# Altium project WL_VHF.PrjPcb
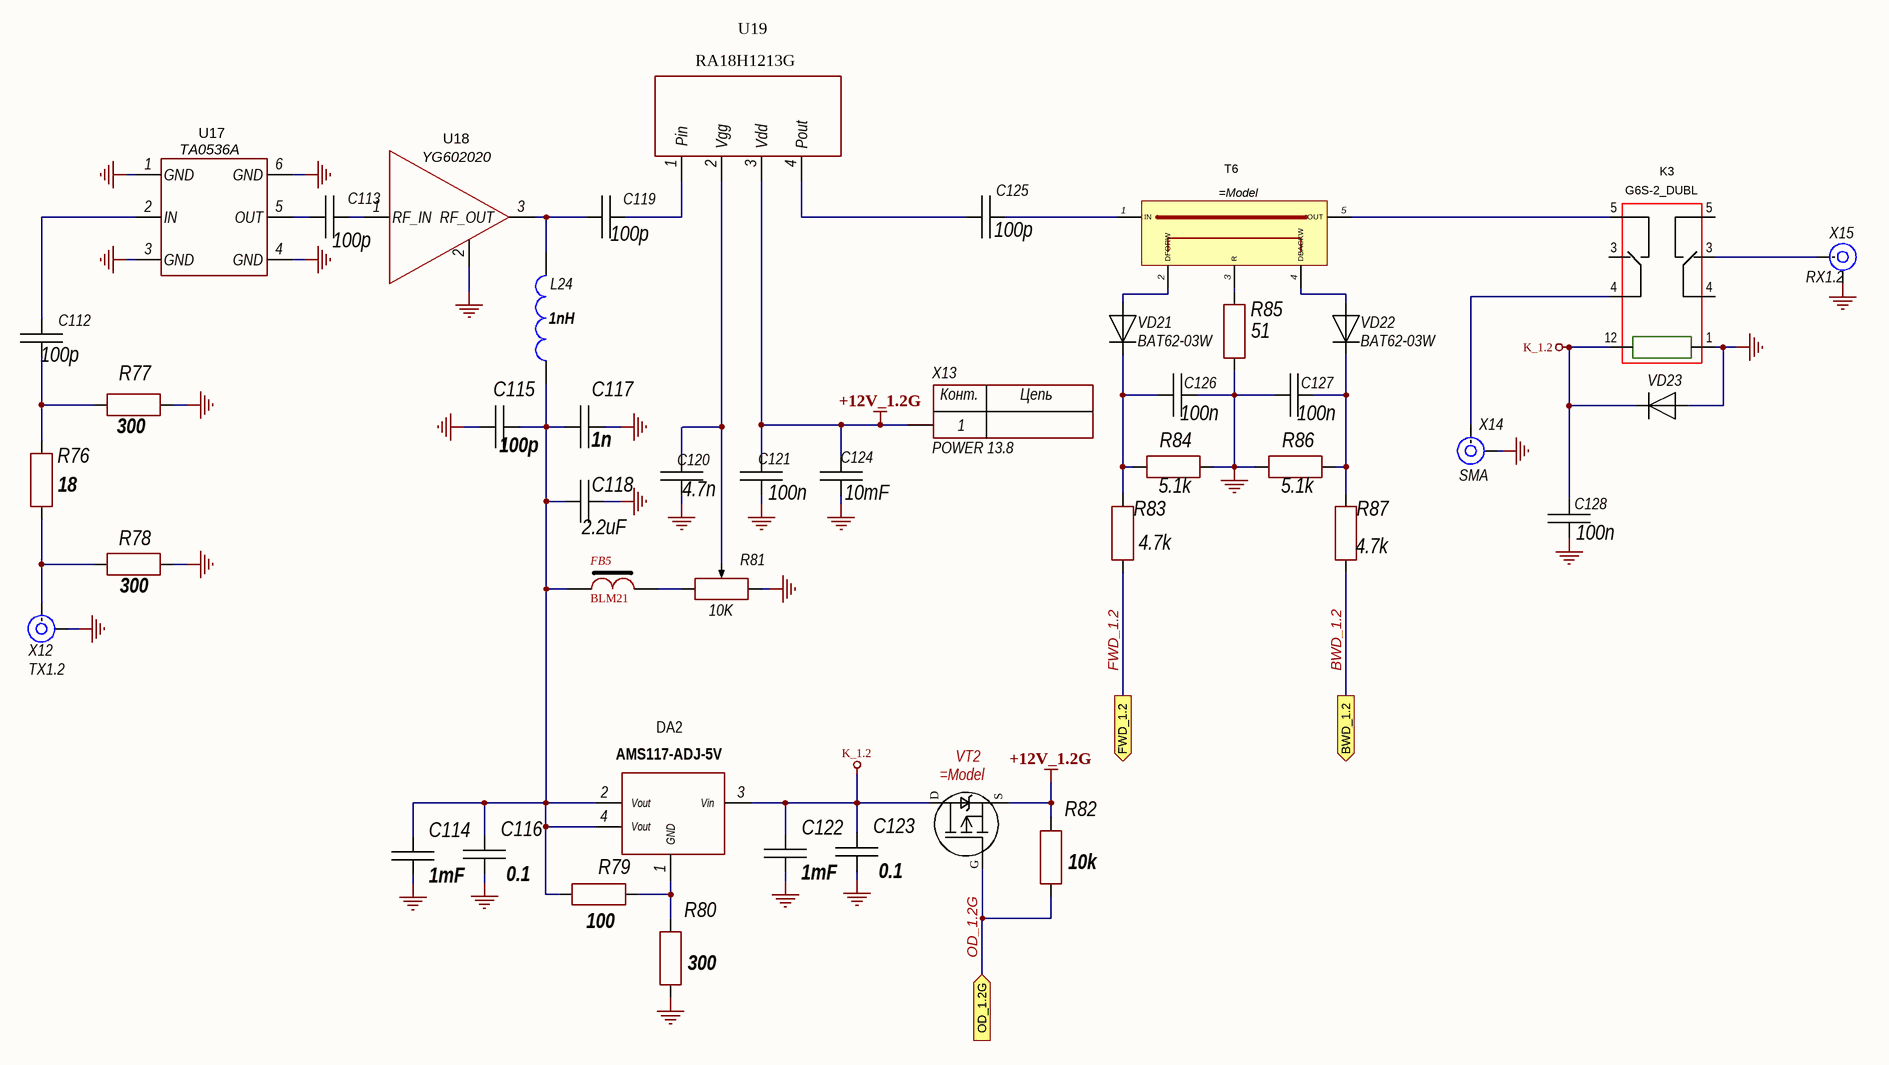
[diagram p0: WL_1.2G.SchDoc]
8 sheets, 334 parts. Net scope: global (net labels, ports and power ports of the same name join across sheets).
Board file: WL_RFFC.PcbDoc
Sheets:
  WL_1.2G.SchDoc
  WL_RFFC.SchDoc
  WL_PGA_ATT.SchDoc
  WL_CON.SchDoc
  WL_RF_SWITCH.SchDoc
  WL_144.SchDoc
  WL_BPF.SchDoc
  WL_430.SchDoc

## Sheet WL_1.2G.SchDoc
size 420 x 297 mm; SheetNumber: 2; SheetTotal: 9

### Parts
C112  100p  [CH0603C]
C113  100p  [CH0603C]
C114  1mF  [CH0603C]
C115  100p  [CH0603C]
C116  0.1  [CH0805C]
C117  1n  [CH0603C]
C118  2.2uF  [CH0603C]
C119  100p  [CH0805C]
C120  4.7n  [CH0805C]
C121  100n  [CH1206C]
C122  1mF  [CH0805C]
C123  0.1  [CH0805C]
C124  10mF  [CH1206C]
C125  100p  [CH1210C]
C126  100n  [CH0603C]
C127  100n  [CH0603C]
C128  100n  [CH0805C]
DA2  AMS117-ADJ-5V  [SOT223]
FB5  BLM21  [CH0805L]
K3  G6S-2_DUBL  [G6S-2_DUBL]
L24  1nH  [katuhka]
R76  18  [CH0603R]
R77  300  [CH0603R]
R78  300  [CH0603R]
R79  100  [CH0805R]
R80  300  [CH0805R]
R81  10K  [RES: 3296W]
R82  10k  [CH0805R]
R83  4.7k  [CH0603R]
R84  5.1k  [CH0603R]
R85  51  [CH1206R]
R86  5.1k  [CH0603R]
R87  4.7k  [CH0603R]
T6  (no value)  [SWR_D]
U17  TA0536A  [MA08803]
U18  YG602020  [SOT89_123]
U19  RA18H1213G  [RA80H1415M1 - duplicate]
VD21  BAT62-03W  [1N4148]
VD22  BAT62-03W  [1N4148]
VD23  (no value)  [1N4148]
VT2  (no value)  [SOT23_132]
X12  TX1.2  [CON: u.Fl]
X13  POWER 13.8  [CON: KNIFE_5MM]
X14  SMA  [CON: SMA]
X15  RX1.2  [CON: u.Fl]

### Ports
BWD_1.2 (out), FWD_1.2 (out), OD_1.2G (in)

### Nets
+12V_1.2G: C121.2 C124.2 R82.2 U19.3(Vdd) VT2.2(Исток) X13.1
GND: C114.1 C115.2 C116.1 C117.2 C118.2 C120.1 C121.1 C122.1 C123.1 C124.1 C126.1 C127.2 C128.2 K3.1 R77.1 R78.1 R80.1 R81.1 R84.1 R85.1 R86.2 U17.1(GND) U17.3(GND) U17.4(GND) U17.6(GND) U18.2(GND) VD23.1 X12.2(IN) X14.2(IN) X15.2(IN)
K_1.2: C122.2 C123.2 C128.1 DA2.3(Vin) K3.12 VD23.2 VT2.3(Сток)
BWD_1.2: R87.2 ; port BWD_1.2
FWD_1.2: R83.2 ; port FWD_1.2
OD_1.2G: R82.1 VT2.1(Затвор(Gate)) ; port OD_1.2G
NetC112_1: C112.1 U17.2(IN)
NetC112_2: C112.2 R76.1 R77.2
NetC113_1: C113.1 U18.1(RF_IN)
NetC113_2: C113.2 U17.5(OUT)
NetC114_2: C114.2 C115.1 C116.2 C117.1 C118.1 DA2.2(Vout) DA2.4(Vout) FB5.1 L24.2 R79.2
NetC119_1: C119.1 U19.1(Pin)
NetC119_2: C119.2 L24.1 U18.3(RF_OUT)
NetC120_2: C120.2 R81.2 U19.2(Vgg)
NetC125_1: C125.1 T6.1(IN)
NetC125_2: C125.2 U19.4(Pout)
NetC126_2: C126.2 R83.1 R84.2 VD21.2
NetC127_1: C127.1 R86.1 R87.1 VD22.2
NetDA2_1: DA2.1(GND) R79.1 R80.2
NetFB5_2: FB5.2 R81.3
NetK3_3: K3.3 X15.1(IN)
NetK3_4: K3.4 X14.1(IN)
NetK3_5: K3.5 T6.5(OUT)
NetR76_2: R76.2 R78.2 X12.1(IN)
NetR85_2: R85.2 T6.3(R)
NetT6_2: T6.2(DFORW) VD21.1
NetT6_4: T6.4(DBACKW) VD22.1

### Notes on the sheet
- Подп. и дата
- Инв. № дубл.
- Взам. инв. №
- Инв. № подл.
- Изм.
- Лист
- № докум.
- Подп.
- Дата
- 2.106-A3
- Копировал
- Формат А3
- (in symbol 1-Connector) Конт.; Цепь
- (in symbol P-KANAL) D; S; G

### Library data of the parts
C112-C128 = Capacitor: Manufacturer: *; Model: *; HelpURL: *; ComponentKind: *; Value: *
DA2 = AMS117
FB5 = FB-1
L24 = Inductor ring: Value: {Value}; Model: *; ComponentKind: *; Manufacturer: *; HelpURL: *
R76-R80 R82-R87 = Resistor: Manufacturer: *; Model: *; HelpURL: *; ComponentKind: *; Value: *
R81 = ADJ resistor: Manufacturer: *; Model: *; HelpURL: *; ComponentKind: *; Value: *
T6 = VHF_KSV1
U17 = TAU692
U19 = RA80H1415M1
VD21-VD23 = Diod: ComponentKind: *; Manufacturer: *; Model: *; HelpURL: *
VT2 = P-KANAL
X12 X14 X15 = SMA: RF; Model: *; Manufacturer: *; HelpURL: *; ComponentKind: *
X13 = 1-Connector: Model: *; Manufacturer: *; HelpURL: *; ComponentKind: *

## Sheet WL_RFFC.SchDoc
size 594 x 420 mm; SheetNumber: 3; SheetTotal: 9
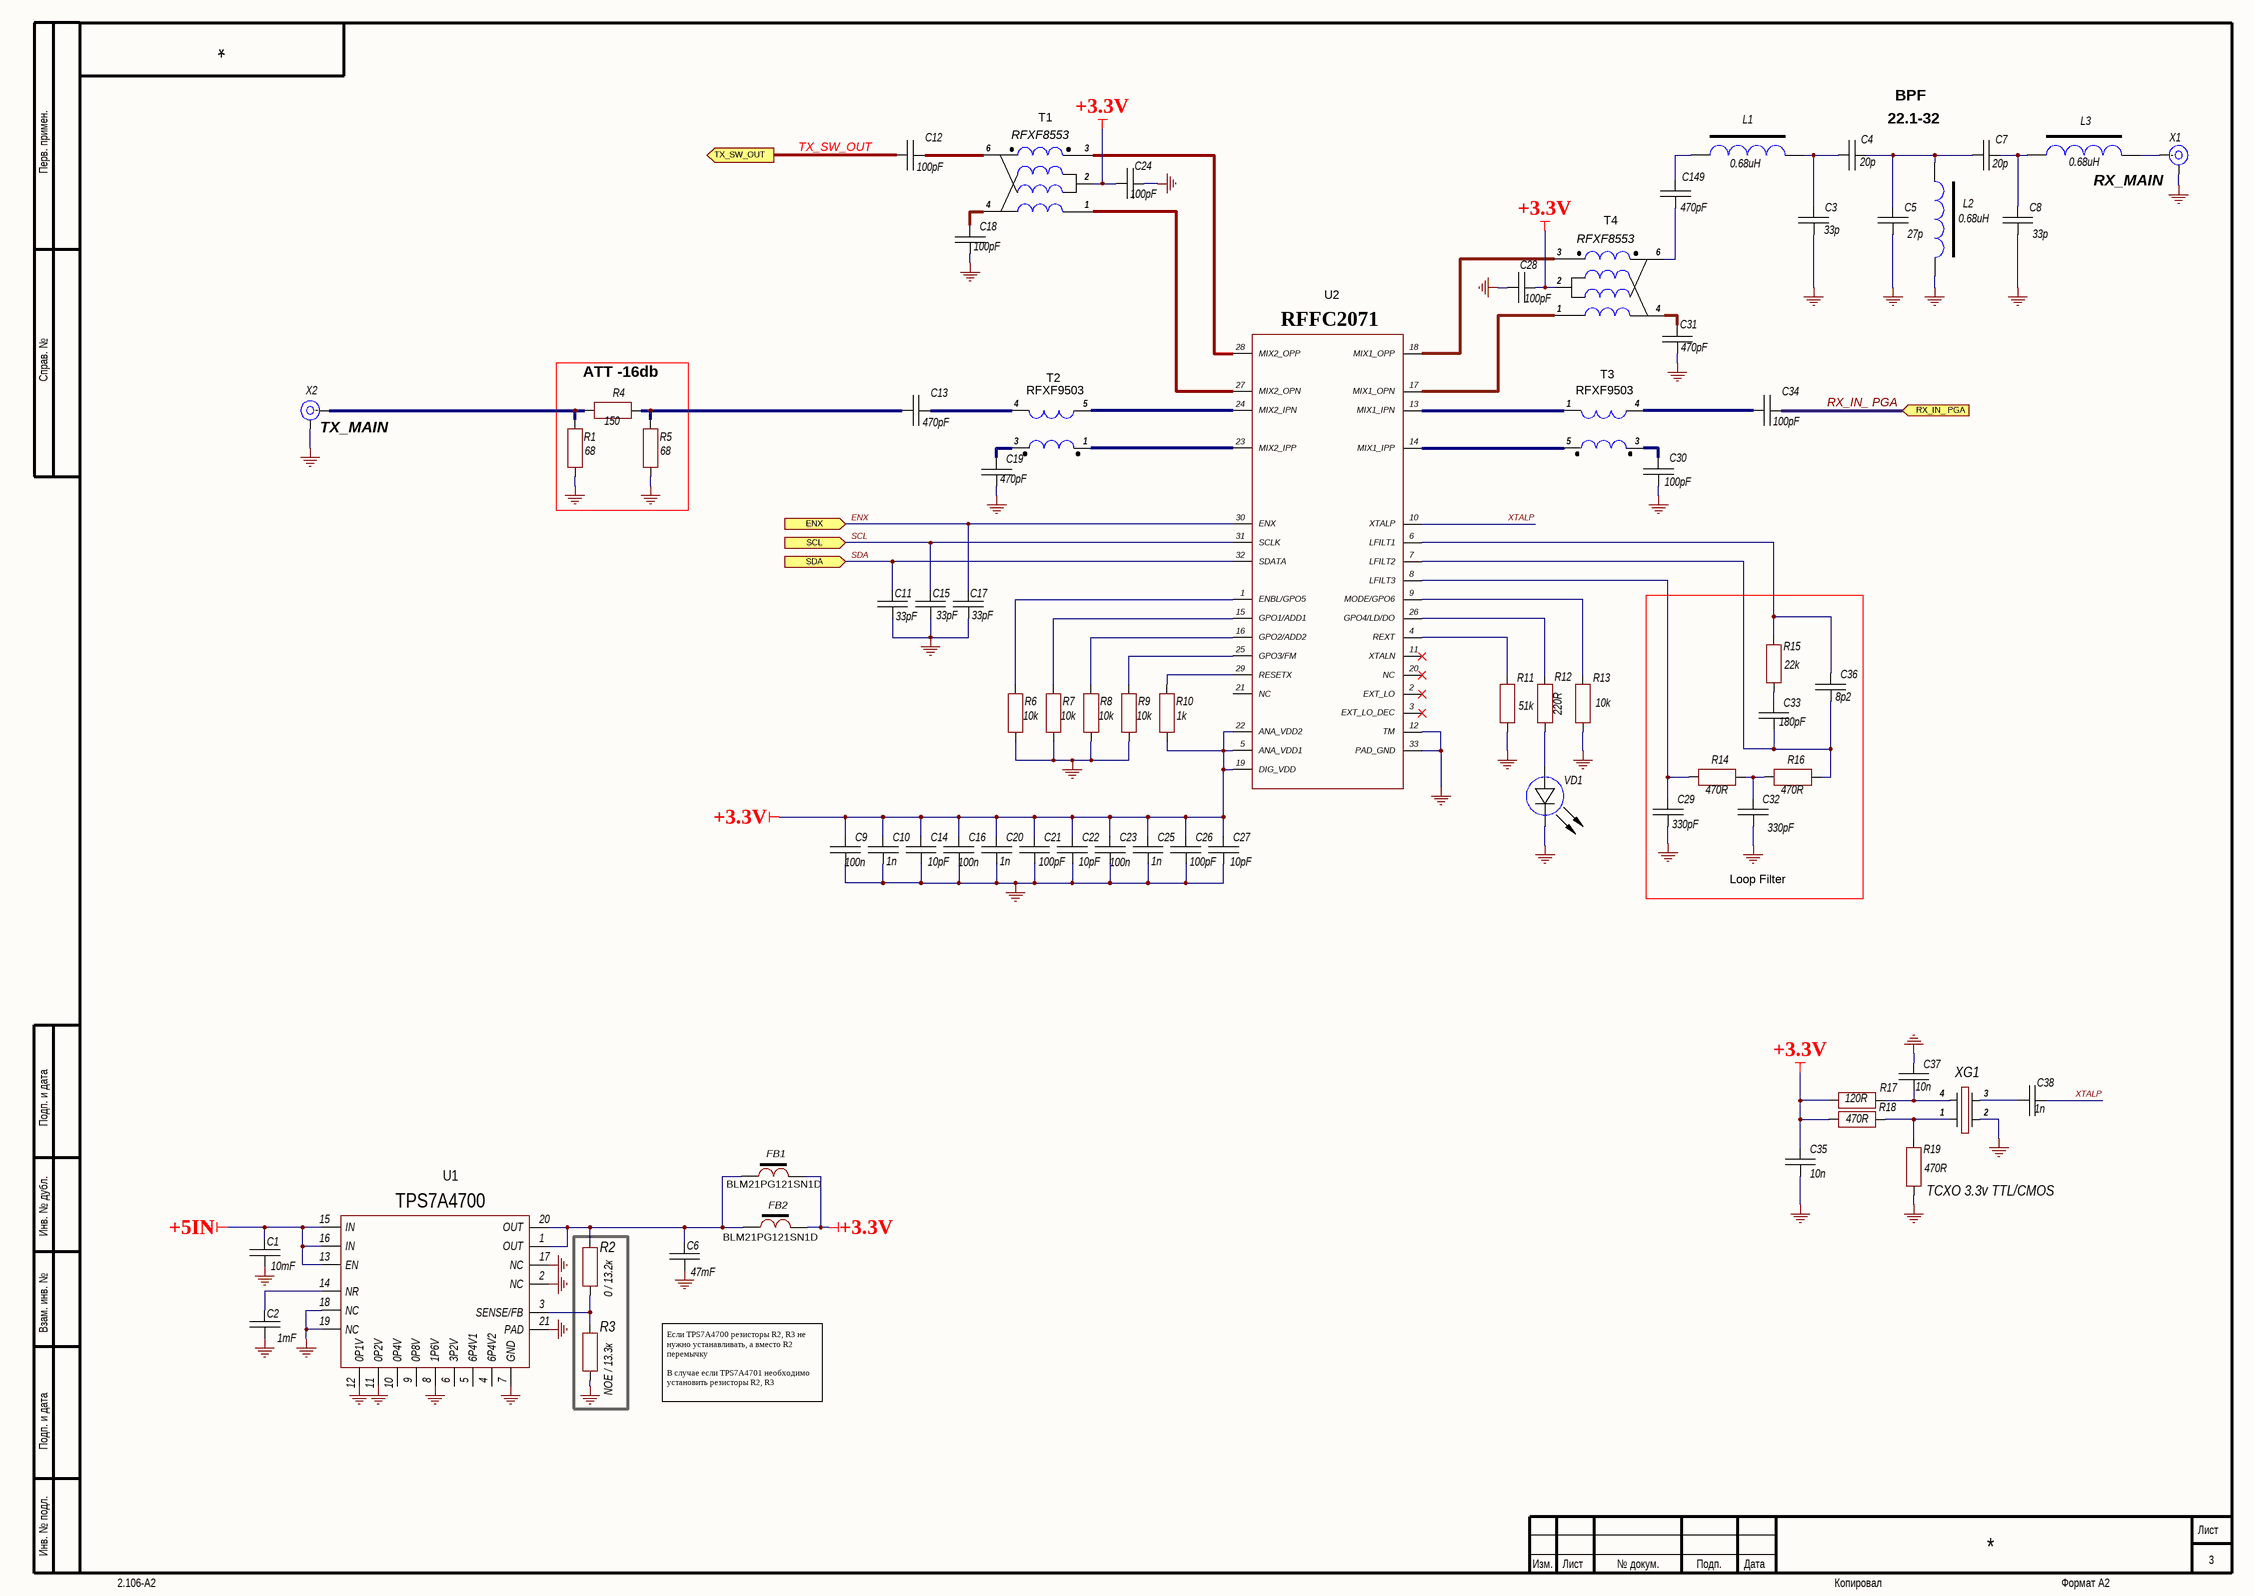
[diagram p1: WL_RFFC.SchDoc]

### Parts
C1  10mF  [CH1206C]
C2  1mF  [CH0805C]
C3  33p  [CH0805C]
C4  20p  [CH0805C]
C5  27p  [CH0805C]
C6  47mF  [CH1206C]
C7  20p  [CH0805C]
C8  33p  [CH0805C]
C9  100n  [CH0805C]
C10  1n  [CH0805C]
C11  33pF  [CH0805C]
C12  100pF  [CH0805C]
C13  470pF  [CH0805C]
C14  10pF  [CH0805C]
C15  33pF  [CH0805C]
C16  100n  [CH0805C]
C17  33pF  [CH0805C]
C18  100pF  [CH0805C]
C19  470pF  [CH0805C]
C20  1n  [CH0805C]
C21  100pF  [CH0805C]
C22  10pF  [CH0805C]
C23  100n  [CH0805C]
C24  100pF  [CH0805C]
C25  1n  [CH0805C]
C26  100pF  [CH0805C]
C27  10pF  [CH0805C]
C28  100pF  [CH0805C]
C29  330pF  [CH0805C]
C30  100pF  [CH0805C]
C31  470pF  [CH0805C]
C32  330pF  [CH0805C]
C33  180pF  [CH0805C]
C34  100pF  [CH0805C]
C35  10n  [CH0805C]
C36  8p2  [CH0805C]
C37  10n  [CH0805C]
C38  1n  [CH0805C]
C149  470pF  [CH0805C]
FB1  BLM21PG121SN1D  [CH0805L]
FB2  BLM21PG121SN1D  [CH0805L]
L1  0.68uH  [L1210]
L2  0.68uH  [L1210]
L3  0.68uH  [L1210]
R1  68  [CH1206R]
R2  0 / 13.2к  [CH0805R]
R3  NOE / 13.3к  [CH0805R]
R4  150  [CH1206R]
R5  68  [CH1206R]
R6  10k  [CH0805R]
R7  10k  [CH0805R]
R8  10k  [CH0805R]
R9  10k  [CH0805R]
R10  1k  [CH0805R]
R11  51k  [CH0805R]
R12  220R  [CH0805R]
R13  10k  [CH0805R]
R14  470R  [CH0805R]
R15  22k  [CH0805R]
R16  470R  [CH0805R]
R17  120R  [CH0805R]
R18  470R  [CH0805R]
R19  470R  [CH0805R]
T1  RFXF8553  [TC4-1-ADT4-6]
T2  RFXF9503  [TC4-1/RFXF8553]
T3  RFXF9503  [TC4-1/RFXF8553]
T4  RFXF8553  [TC4-1-ADT4-6]
U1  TPS7A4700  [20-VQFN (5x5 mm)]
U2  RFFC2071  [32-VQFN (5x5 mm)]
VD1  *  [CH0805LB]  (value not drawn)
X1  RX_MAIN  [CON: SMA]
X2  TX_MAIN  [CON: SMA]
XG1  TCXO 3.3v TTL/CMOS  [TCXO]

### Blocks framed on the sheet
ATT -16db: R1 R4 R5
Loop Filter: C29 C32 C33 C36 R14-R16

### Ports
ENX (in), RX_IN_ PGA (in), SCL (in), SDA (in), TX_SW_OUT (out)

### Nets
+3.3V: C9.2 C10.2 C14.2 C16.2 C20.2 C21.2 C22.2 C23.2 C24.2 C25.2 C26.2 C27.2 C28.2 C35.2 FB1.2 FB2.2 R10.2 R17.1 R18.1 T1.2 T4.2 U2.5(ANA_VDD1) U2.19(DIG_VDD) U2.22(ANA_VDD2)
+5IN: C1.2 U1.13(EN) U1.15(IN) U1.16(IN)
GND: C1.1 C2.1 C3.1 C5.1 C6.1 C8.1 C9.1 C10.1 C11.1 C14.1 C15.1 C16.1 C17.1 C18.2 C19.2 C20.1 C21.1 C22.1 C23.1 C24.1 C25.1 C26.1 C27.1 C28.1 C29.1 C30.2 C31.2 C32.1 C35.1 C37.2 L2.1 R1.2 R3.1 R5.2 R6.2 R7.2 R8.2 R9.2 R11.2 R13.2 R19.1 U1.2(NC) U1.7(GND) U1.8(1P6V) U1.11(0P2V) U1.12(0P1V) U1.17(NC) U1.18(NC) U1.19(NC) U1.21(PAD) U2.12(TM) U2.33(PAD_GND) VD1.2(C) X1.2(IN) X2.2(IN) XG1.2
ENX: C17.2 U2.30(ENX) ; port ENX
RX_IN_ PGA: C34.1 ; port RX_IN_ PGA
SCL: C15.2 U2.31(SCLK) ; port SCL
SDA: C11.2 U2.32(SDATA) ; port SDA
TX_SW_OUT: C12.1 ; port TX_SW_OUT
XTALP: C38.1 U2.10(XTALP)
NetC2_2: C2.2 U1.14(NR)
NetC3_2: C3.2 C4.1 L1.2
NetC4_2: C4.2 C5.2 C7.1 L2.2
NetC6_2: C6.2 FB1.1 FB2.1 R2.2 U1.1(OUT) U1.20(OUT)
NetC7_2: C7.2 C8.2 L3.1
NetC12_2: C12.2 T1.6
NetC13_1: C13.1 R4.2 R5.1
NetC13_2: C13.2 T2.4
NetC18_1: C18.1 T1.4
NetC19_1: C19.1 T2.3
NetC29_2: C29.2 R14.1 U2.8(LFILT3)
NetC30_1: C30.1 T3.3
NetC31_1: C31.1 T4.4
NetC32_2: C32.2 R14.2 R16.1
NetC33_1: C33.1 C36.1 R16.2 U2.7(LFILT2)
NetC33_2: C33.2 R15.1
NetC34_2: C34.2 T3.4
NetC36_2: C36.2 R15.2 U2.6(LFILT1)
NetC37_1: C37.1 R17.2 XG1.4
NetC38_2: C38.2 XG1.3
NetC149_1: C149.1 L1.1
NetC149_2: C149.2 T4.6
NetL3_2: L3.2 X1.1(IN)
NetR1_1: R1.1 R4.1 X2.1(IN)
NetR2_1: R2.1 R3.2 U1.3(SENSE/FB)
NetR6_1: R6.1 U2.1(ENBL/GPO5)
NetR7_1: R7.1 U2.15(GPO1/ADD1)
NetR8_1: R8.1 U2.16(GPO2/ADD2)
NetR9_1: R9.1 U2.25(GPO3/FM)
NetR10_1: R10.1 U2.29(RESETX)
NetR11_1: R11.1 U2.4(REXT)
NetR12_1: R12.1 U2.26(GPO4/LD/DO)
NetR12_2: R12.2 VD1.1(A)
NetR13_1: R13.1 U2.9(MODE/GPO6)
NetR18_2: R18.2 R19.2 XG1.1
NetT1_1: T1.1 U2.27(MIX2_OPN)
NetT1_3: T1.3 U2.28(MIX2_OPP)
NetT2_1: T2.1 U2.23(MIX2_IPP)
NetT2_5: T2.5 U2.24(MIX2_IPN)
NetT3_1: T3.1 U2.13(MIX1_IPN)
NetT3_5: T3.5 U2.14(MIX1_IPP)
NetT4_1: T4.1 U2.17(MIX1_OPN)
NetT4_3: T4.3 U2.18(MIX1_OPP)

Not connected (* = marked no-connect by the designer): U1 4(6P4V2) 5(6P4V1) 6(3P2V) 9(0P8V) 10(0P4V); U2 2(EXT_LO)* 3(EXT_LO_DEC)* 11(XTALN)* 20(NC)* 21(NC)

### Notes on the sheet
- BPF
- 22.1-32
- Если TPS7A4700 резисторы R2, R3 не нужно устанавливать, а вместо R2 перемычку
  В случае если TPS7A4701 необходимо установить резисторы R2, R3
- Перв. примен.
- Справ. №
- Подп. и дата
- Инв. № дубл.
- Взам. инв. №
- Инв. № подл.
- Изм.
- Лист
- № докум.
- Подп.
- Дата
- 2.106-A2
- Копировал
- Формат А2

### Library data of the parts
C1-C38 C149 = Capacitor: Manufacturer: *; Model: *; HelpURL: *; ComponentKind: *; Value: *
FB1 FB2 = FB-1
L1-L3 = TRANS
R1-R19 = Resistor: Manufacturer: *; Model: *; HelpURL: *; ComponentKind: *; Value: *
VD1 = LED: Manufacturer: *; Model: *; HelpURL: *; ComponentKind: *; Value: *
X1 X2 = SMA: RF; Model: *; Manufacturer: *; HelpURL: *; ComponentKind: *
XG1 = Generator: Manufacturer: *; Model: *; HelpURL: *; ComponentKind: *; Value: *

## Sheet WL_PGA_ATT.SchDoc
size 420 x 297 mm; SheetNumber: 4; SheetTotal: 9
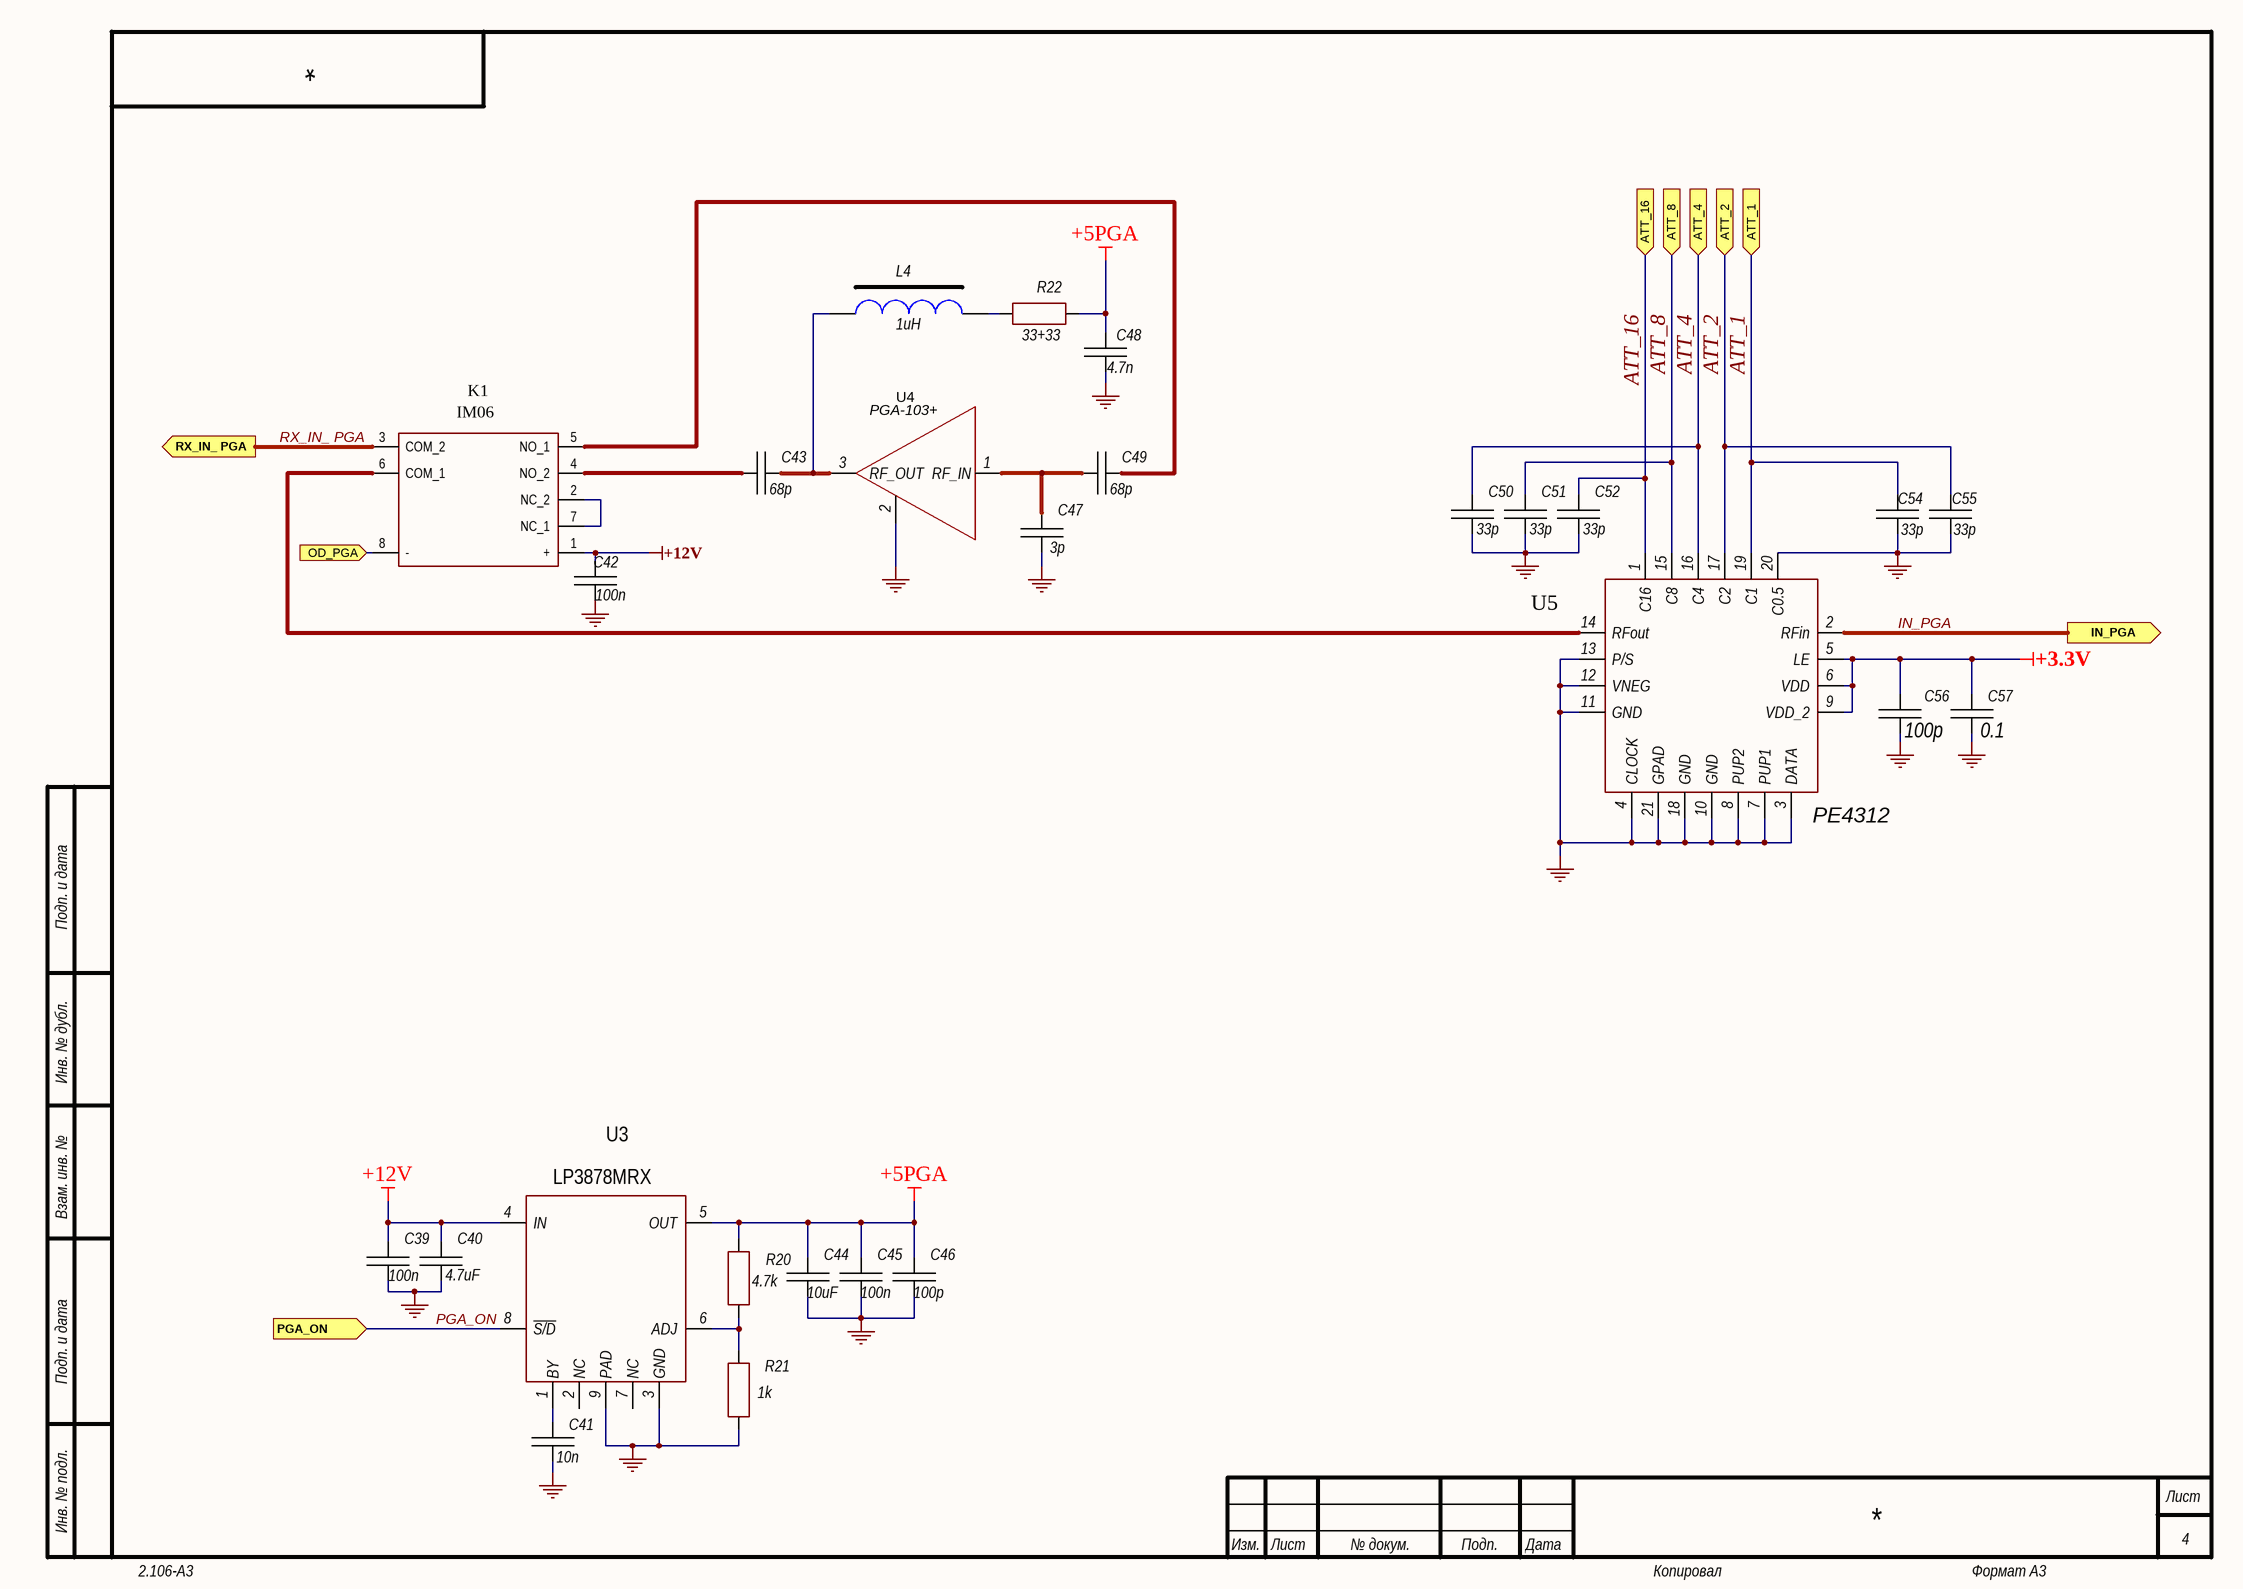
[diagram p2: WL_PGA_ATT.SchDoc]

### Parts
C39  100n  [CH0805C]
C40  4.7uF  [CH0805C]
C41  10n  [CH0805C]
C42  100n  [CH0805C]
C43  68p  [CH0805C]
C44  10uF  [CH0805C]
C45  100n  [CH0805C]
C46  100p  [CH0805C]
C47  3p  [CH0805C]
C48  4.7n  [CH0805C]
C49  68p  [CH0805C]
C50  33p  [CH0603C]
C51  33p  [CH0603C]
C52  33p  [CH0603C]
C54  33p  [CH0603C]
C55  33p  [CH0603C]
C56  100p  [CH0805C]
C57  0.1  [CH0805C]
K1  IM06  [IM06]
L4  1uH  [L1210]
R20  4.7k  [CH0805R]
R21  1k  [CH0805R]
R22  33+33  [CH1206R]
U3  LP3878MRX  [8-SOIC (PAD)]
U4  PGA-103+  [SOT89_123]
U5  PE4312  [20-QFN (4x4)]

### Ports
ATT_1 (in), ATT_2 (in), ATT_4 (in), ATT_8 (in), ATT_16 (in), IN_PGA (out), OD_PGA (in), PGA_ON (in), RX_IN_ PGA (out)

### Nets
+3.3V: C56.1 C57.1 U5.5(LE) U5.6(VDD) U5.9(VDD_2)
+5PGA: C44.2 C45.2 C46.2 C48.2 R20.2 R22.2 U3.5(OUT)
+12V: C39.2 C40.2 C42.2 K1.1(+) U3.4(IN)
GND: C39.1 C40.1 C41.1 C42.1 C44.1 C45.1 C46.1 C47.1 C48.1 C50.1 C51.1 C52.1 C54.1 C55.1 C56.2 C57.2 R21.1 U3.3(GND) U3.9(PAD) U4.2(GND) U5.3(DATA) U5.4(CLOCK) U5.7(PUP1) U5.8(PUP2) U5.10(GND) U5.11(GND) U5.12(VNEG) U5.13(P/S) U5.18(GND) U5.20(C0.5) U5.21(GPAD)
ATT_1: C54.2 U5.19(C1) ; port ATT_1
ATT_2: C55.2 U5.17(C2) ; port ATT_2
ATT_4: C50.2 U5.16(C4) ; port ATT_4
ATT_8: C51.2 U5.15(C8) ; port ATT_8
ATT_16: C52.2 U5.1(C16) ; port ATT_16
IN_PGA: U5.2(RFin) ; port IN_PGA
OD_PGA: K1.8(-) ; port OD_PGA
PGA_ON: U3.8(~{S/D}) ; port PGA_ON
RX_IN_ PGA: K1.3(COM_2) ; port RX_IN_ PGA
NetC41_2: C41.2 U3.1(BY)
NetC43_1: C43.1 K1.4(NO_2)
NetC43_2: C43.2 L4.2 U4.3(RF_OUT)
NetC47_2: C47.2 C49.1 U4.1(RF_IN)
NetC49_2: C49.2 K1.5(NO_1)
NetK1_2: K1.2(NC_2) K1.7(NC_1)
NetK1_6: K1.6(COM_1) U5.14(RFout)
NetL4_1: L4.1 R22.1
NetR20_1: R20.1 R21.2 U3.6(ADJ)

Not connected (* = marked no-connect by the designer): U3 2(NC) 7(NC)

### Notes on the sheet
- Подп. и дата
- Инв. № дубл.
- Взам. инв. №
- Инв. № подл.
- Изм.
- Лист
- № докум.
- Подп.
- Дата
- 2.106-A3
- Копировал
- Формат А3

### Library data of the parts
C39-C52 C54-C57 = Capacitor: Manufacturer: *; Model: *; HelpURL: *; ComponentKind: *; Value: *
K1 = IM06-V1
L4 = TRANS
R20-R22 = Resistor: Manufacturer: *; Model: *; HelpURL: *; ComponentKind: *; Value: *
U3 = LP3878
U5 = PE4302

## Sheet WL_CON.SchDoc
size 420 x 297 mm; SheetNumber: 5; SheetTotal: 9
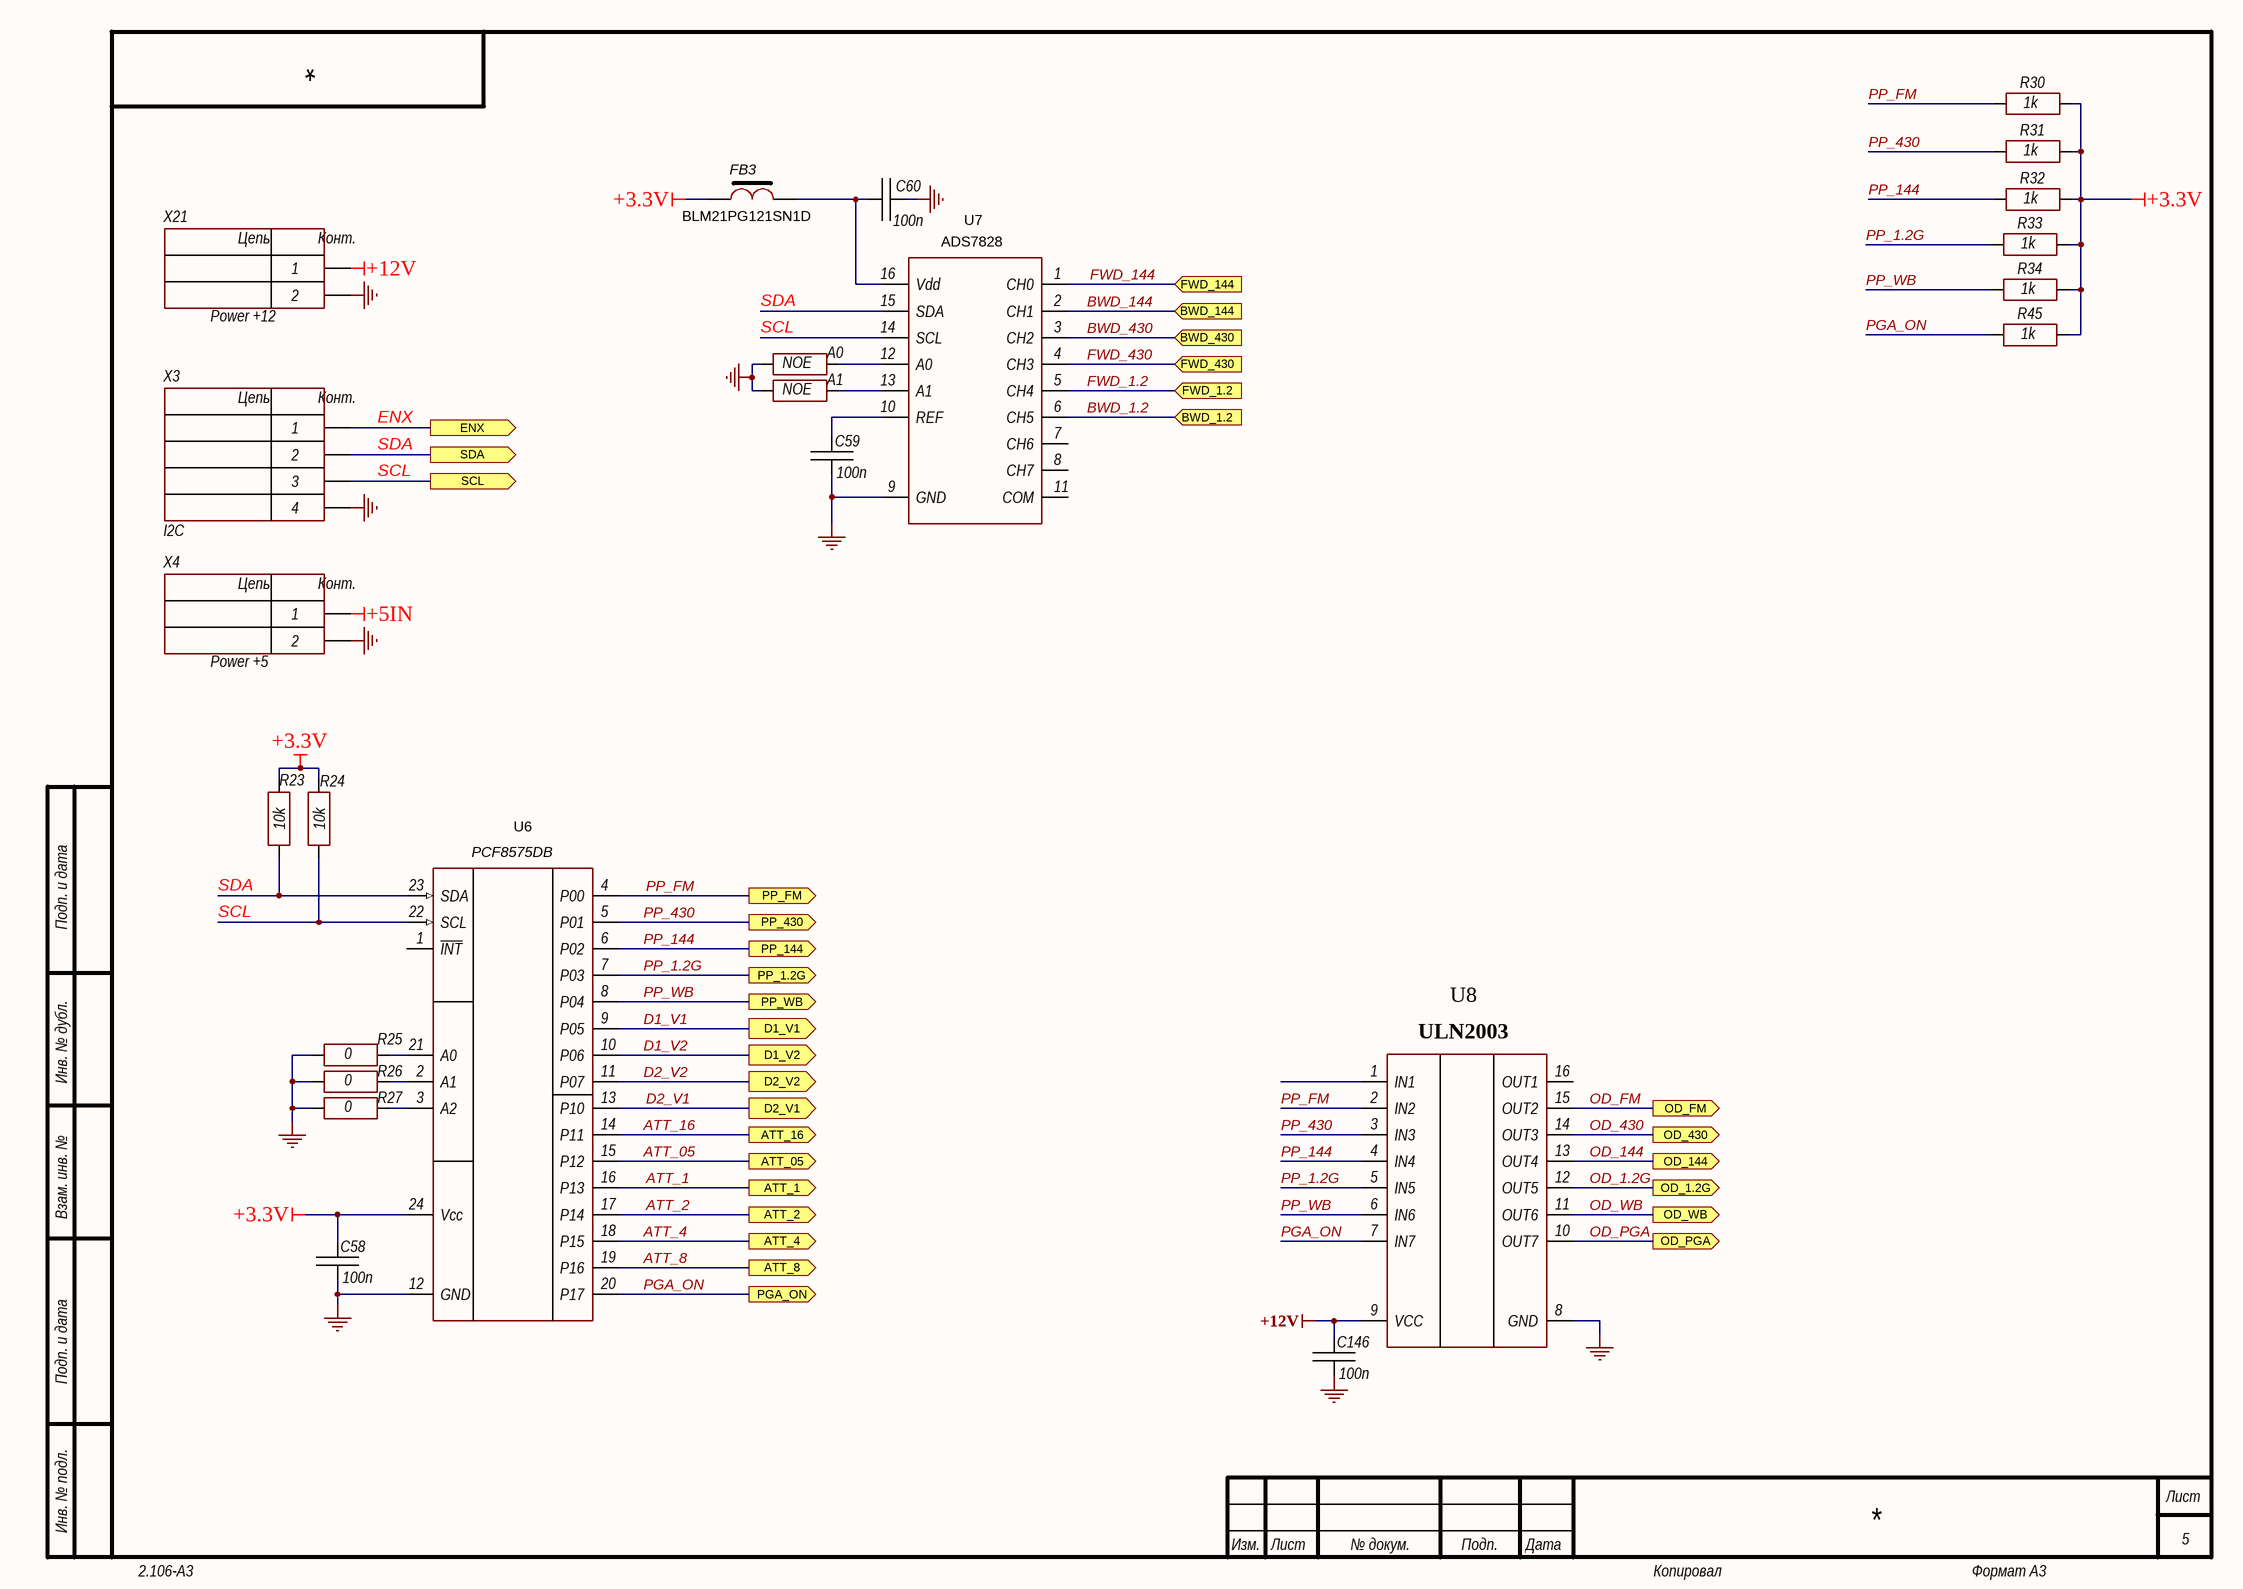
[diagram p3: WL_CON.SchDoc]

### Parts
A0  NOE  [CH0805R]
A1  NOE  [CH0805R]
C58  100n  [CH0805C]
C59  100n  [CH0805C]
C60  100n  [CH0805C]
C146  100n  [CH0805C]
FB3  BLM21PG121SN1D  [CH0805L]
R23  10k  [CH0805R]
R24  10k  [CH0805R]
R25  0  [CH0805R]
R26  0  [CH0805R]
R27  0  [CH0805R]
R30  1k  [CH0603R]
R31  1k  [CH0603R]
R32  1k  [CH0603R]
R33  1k  [CH0603R]
R34  1k  [CH0603R]
R45  1k  [CH0603R]
U6  PCF8575DB  [24-TSSOP_HIR]
U7  ADS7828  [16-SSOP]
U8  ULN2003  [16-SOIC]
X3  I2C  [CON: CWF-4]
X4  Power +5  [CON: CWF-2]
X21  Power +12  [CON: CWF-2]

### Ports
ATT_1 (out), ATT_2 (out), ATT_4 (out), ATT_05 (out), ATT_8 (out), ATT_16 (out), BWD_1.2 (in), BWD_144 (in), BWD_430 (in), D1_V1 (out), D1_V2 (out), D2_V1 (out), D2_V2 (out), ENX (out), FWD_1.2 (in), FWD_144 (in), FWD_430 (in), OD_1.2G (out), OD_144 (out), OD_430 (out), OD_FM (out), OD_PGA (out), OD_WB (out), PGA_ON (out), PP_1.2G (out), PP_144 (out), PP_430 (out), PP_FM (out), PP_WB (out), SCL (out), SDA (out)

### Nets
+3.3V: C58.2 FB3.1 R23.1 R24.1 R30.2 R31.2 R32.2 R33.2 R34.2 R45.2 U6.24(Vcc)
+5IN: X4.1
+12V: C146.2 U8.9(VCC) X21.1
GND: A0.1 A1.1 C58.1 C59.1 C60.1 C146.1 R25.1 R26.1 R27.1 U6.12(GND) U7.9(GND) U8.8(GND) X3.4 X4.2 X21.2
ATT_1: U6.16(P13) ; port ATT_1
ATT_2: U6.17(P14) ; port ATT_2
ATT_4: U6.18(P15) ; port ATT_4
ATT_05: U6.15(P12) ; port ATT_05
ATT_8: U6.19(P16) ; port ATT_8
ATT_16: U6.14(P11) ; port ATT_16
BWD_1.2: U7.6(CH5) ; port BWD_1.2
BWD_144: U7.2(CH1) ; port BWD_144
BWD_430: U7.3(CH2) ; port BWD_430
D1_V1: U6.9(P05) ; port D1_V1
D1_V2: U6.10(P06) ; port D1_V2
D2_V1: U6.13(P10) ; port D2_V1
D2_V2: U6.11(P07) ; port D2_V2
ENX: X3.1 ; port ENX
FWD_1.2: U7.5(CH4) ; port FWD_1.2
FWD_144: U7.1(CH0) ; port FWD_144
FWD_430: U7.4(CH3) ; port FWD_430
OD_1.2G: U8.12(OUT5) ; port OD_1.2G
OD_144: U8.13(OUT4) ; port OD_144
OD_430: U8.14(OUT3) ; port OD_430
OD_FM: U8.15(OUT2) ; port OD_FM
OD_PGA: U8.10(OUT7) ; port OD_PGA
OD_WB: U8.11(OUT6) ; port OD_WB
PGA_ON: R45.1 U6.20(P17) U8.7(IN7) ; port PGA_ON
PP_1.2G: R33.1 U6.7(P03) U8.5(IN5) ; port PP_1.2G
PP_144: R32.1 U6.6(P02) U8.4(IN4) ; port PP_144
PP_430: R31.1 U6.5(P01) U8.3(IN3) ; port PP_430
PP_FM: R30.1 U6.4(P00) U8.2(IN2) ; port PP_FM
PP_WB: R34.1 U6.8(P04) U8.6(IN6) ; port PP_WB
SCL: R24.2 U6.22(SCL) U7.14(SCL) X3.3 ; port SCL
SDA: R23.2 U6.23(SDA) U7.15(SDA) X3.2 ; port SDA
NetA0_2: A0.2 U7.12(A0)
NetA1_2: A1.2 U7.13(A1)
NetC59_2: C59.2 U7.10(REF)
NetC60_2: C60.2 FB3.2 U7.16(Vdd)
NetR25_2: R25.2 U6.21(A0)
NetR26_2: R26.2 U6.2(A1)
NetR27_2: R27.2 U6.3(A2)

Not connected (* = marked no-connect by the designer): U6 1(~{INT}); U7 7(CH6) 8(CH7) 11(COM); U8 1(IN1) 16(OUT1)

### Notes on the sheet
- Подп. и дата
- Инв. № дубл.
- Взам. инв. №
- Инв. № подл.
- Изм.
- Лист
- № докум.
- Подп.
- Дата
- 2.106-A3
- Копировал
- Формат А3
- (in symbol 2-Connector) Цепь; Конт.
- (in symbol 4-Connector) Цепь; Конт.

### Library data of the parts
A0 A1 R23-R27 R30-R34 R45 = Resistor: Manufacturer: *; Model: *; HelpURL: *; ComponentKind: *; Value: *
C58-C60 C146 = Capacitor: Manufacturer: *; Model: *; HelpURL: *; ComponentKind: *; Value: *
FB3 = FB-1
U6 = PCF8575
U8 = ULN2003_NEW
X3 = 4-Connector: Model: *; Manufacturer: *; HelpURL: *; ComponentKind: *
X4 X21 = 2-Connector: Model: *; Manufacturer: *; HelpURL: *; ComponentKind: *

## Sheet WL_RF_SWITCH.SchDoc
size 420 x 297 mm; SheetNumber: 6; SheetTotal: 9
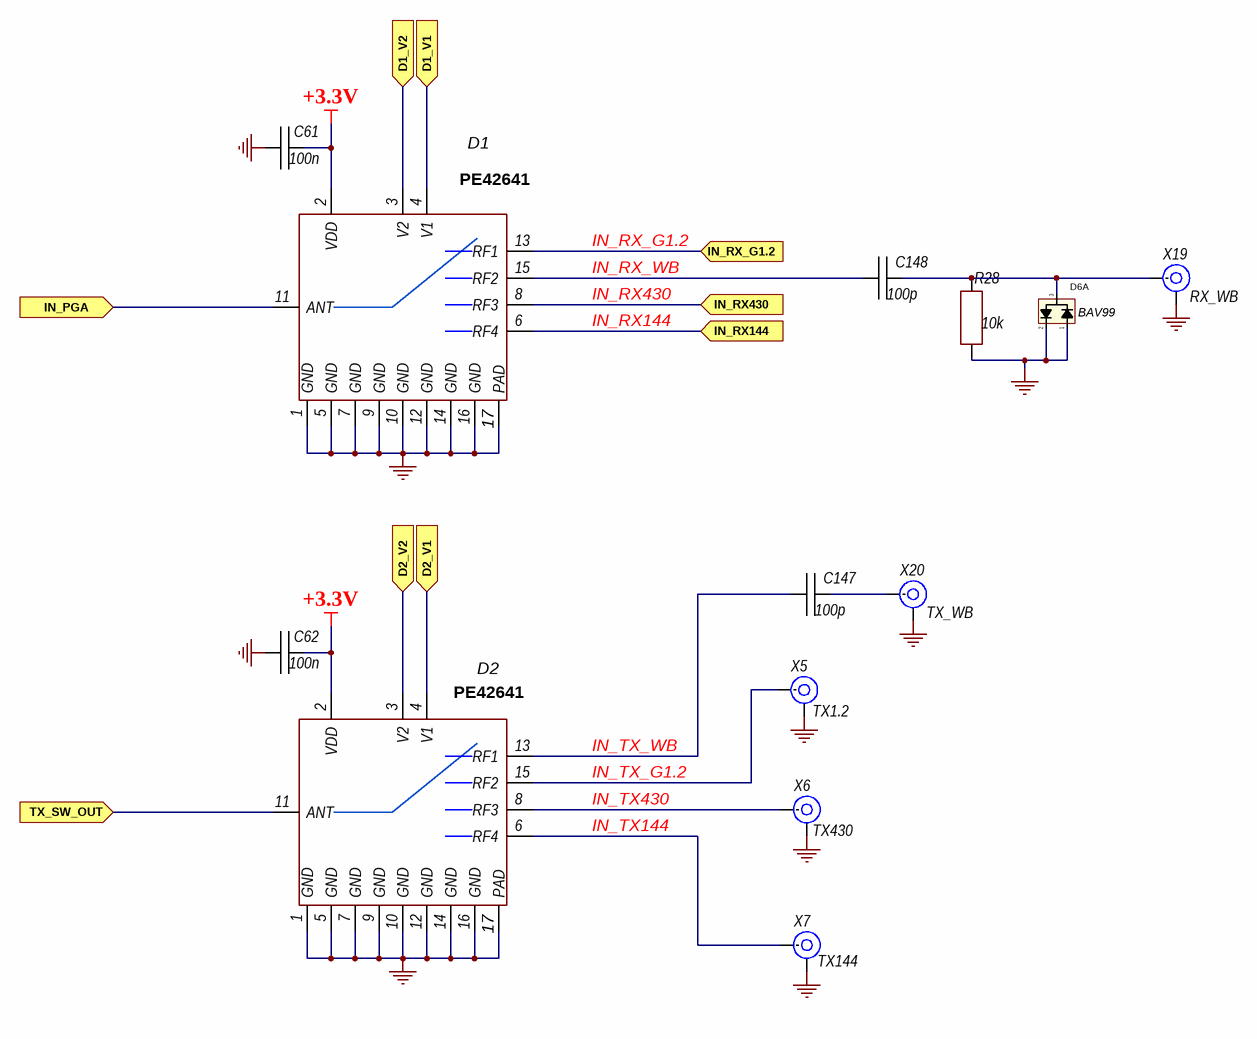
[diagram p4: WL_RF_SWITCH.SchDoc]

### Parts
C61  100n  [CH0805C]
C62  100n  [CH0805C]
C147  100p  [CH0603C]
C148  100p  [CH0805C]
D1  PE42641  [16-QFN (3x3)]
D2  PE42641  [16-QFN (3x3)]
D6  BAV99  [SOT23_132]  (part A of 2)
R28  10k  [CH0805R]
X5  TX1.2  [CON: u.Fl]
X6  TX430  [CON: u.Fl]
X7  TX144  [CON: u.Fl]
X19  RX_WB  [CON: u.Fl]
X20  TX_WB  [CON: u.Fl]

### Ports
D1_V1 (in), D1_V2 (in), D2_V1 (in), D2_V2 (in), IN_PGA (in), IN_RX144 (in), IN_RX430 (in), IN_RX_G1.2 (in), TX_SW_OUT (in)

### Nets
+3.3V: C61.1 C62.1 D1.2(VDD) D2.2(VDD)
GND: C61.2 C62.2 D1.1(GND) D1.5(GND) D1.7(GND) D1.9(GND) D1.10(GND) D1.12(GND) D1.14(GND) D1.16(GND) D1.17(PAD) D2.1(GND) D2.5(GND) D2.7(GND) D2.9(GND) D2.10(GND) D2.12(GND) D2.14(GND) D2.16(GND) D2.17(PAD) D6.1 D6.2 R28.1 X5.2(IN) X6.2(IN) X7.2(IN) X19.2(IN) X20.2(IN)
D1_V1: D1.4(V1) ; port D1_V1
D1_V2: D1.3(V2) ; port D1_V2
D2_V1: D2.4(V1) ; port D2_V1
D2_V2: D2.3(V2) ; port D2_V2
IN_PGA: D1.11(ANT) ; port IN_PGA
IN_RX144: D1.6(RF4) ; port IN_RX144
IN_RX430: D1.8(RF3) ; port IN_RX430
IN_RX_G1.2: D1.13(RF1) ; port IN_RX_G1.2
IN_RX_WB: C148.1 D1.15(RF2)
IN_TX144: D2.6(RF4) X7.1(IN)
IN_TX430: D2.8(RF3) X6.1(IN)
IN_TX_G1.2: D2.15(RF2) X5.1(IN)
IN_TX_WB: C147.1 D2.13(RF1)
TX_SW_OUT: D2.11(ANT) ; port TX_SW_OUT
NetC147_2: C147.2 X20.1(IN)
NetC148_2: C148.2 D6.3 R28.2 X19.1(IN)

### Notes on the sheet
- Подп. и дата
- Инв. № дубл.
- Взам. инв. №
- Инв. № подл.
- Лист
- Изм.
- № докум.
- Подп.
- Дата
- Копировал
- Формат А3

### Library data of the parts
C61 C62 C147 C148 = Capacitor: Manufacturer: *; Model: *; HelpURL: *; ComponentKind: *; Value: *
R28 = Resistor: Manufacturer: *; Model: *; HelpURL: *; ComponentKind: *; Value: *
X5-X7 X19 X20 = SMA: RF; Model: *; Manufacturer: *; HelpURL: *; ComponentKind: *

## Sheet WL_144.SchDoc
size 594 x 420 mm; SheetNumber: 7; SheetTotal: 9
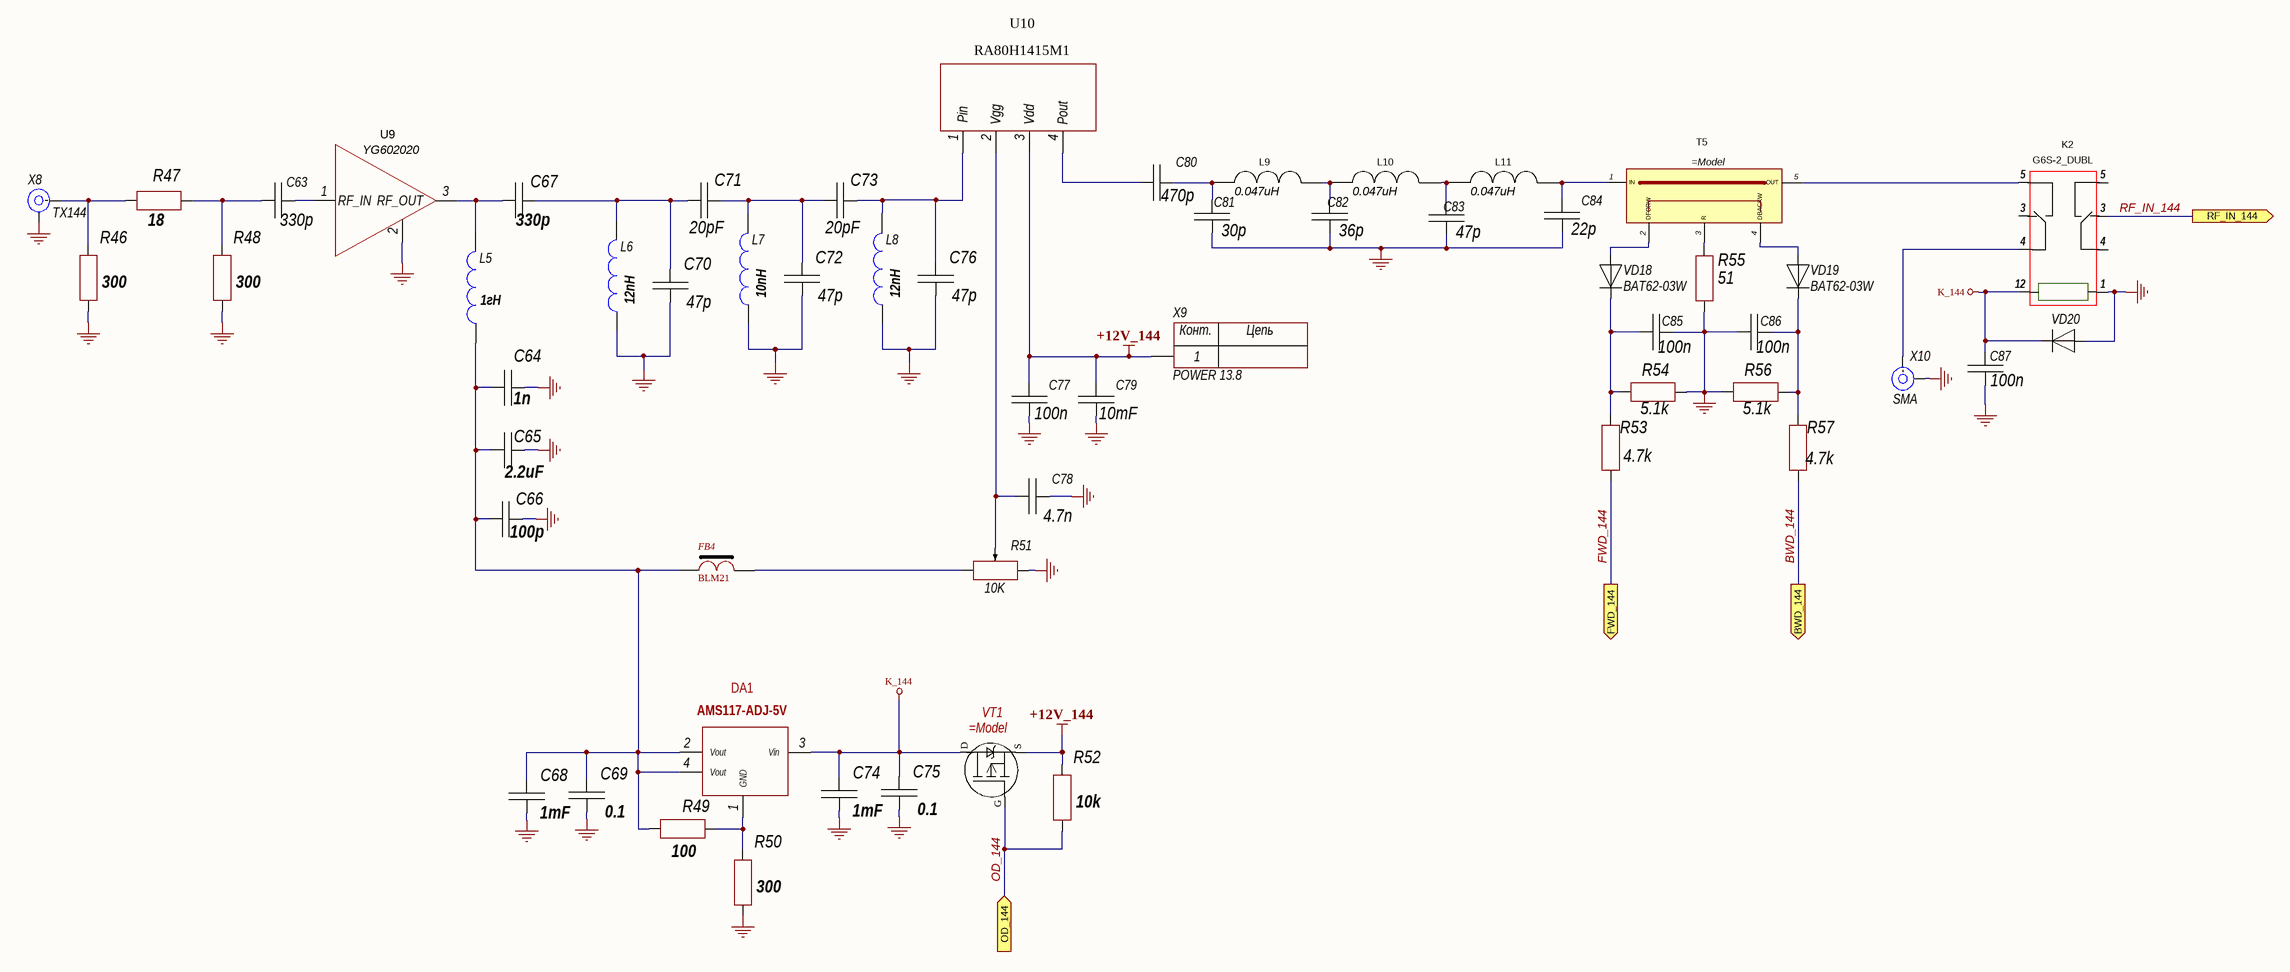
[diagram p5: WL_144.SchDoc]

### Parts
C63  330p  [CH0805C]
C64  1n  [CH0805C]
C65  2.2uF  [CH0805C]
C66  100p  [CH0805C]
C67  330p  [CH0805C]
C68  1mF  [CH0805C]
C69  0.1  [CH0805C]
C70  47p  [CH0805C]
C71  20pF  [CH0805C]
C72  47p  [CH0805C]
C73  20pF  [CH0805C]
C74  1mF  [CH0805C]
C75  0.1  [CH0805C]
C76  47p  [CH0805C]
C77  100n  [CH1206C]
C78  4.7n  [CH0805C]
C79  10mF  [CH1206C]
C80  470p  [CH1206C]
C81  30p  [CH1206C]
C82  36p  [CH1206C]
C83  47p  [CH1206C]
C84  22p  [CH1206C]
C85  100n  [CH0805C]
C86  100n  [CH0805C]
C87  100n  [CH0805C]
DA1  AMS117-ADJ-5V  [SOT223]
FB4  BLM21  [CH0805L]
K2  G6S-2_DUBL  [G6S-2_DUBL]
L5  1гH  [katuhka]
L6  12nH  [katuhka]
L7  10nH  [katuhka]
L8  12nH  [katuhka]
L9  0.047uH  [L-FNC_V3]
L10  0.047uH  [L-FNC_V3]
L11  0.047uH  [L-FNC_V3]
R46  300  [CH0805R]
R47  18  [CH0805R]
R48  300  [CH0805R]
R49  100  [CH0805R]
R50  300  [CH0805R]
R51  10K  [RES: 3296W]
R52  10k  [CH0805R]
R53  4.7k  [CH0805R]
R54  5.1k  [CH0805R]
R55  51  [CH1206R]
R56  5.1k  [CH0805R]
R57  4.7k  [CH0805R]
T5  (no value)  [SWR_D]
U9  YG602020  [SOT89_123]
U10  RA80H1415M1  [RA80H1415M1 - duplicate]
VD18  BAT62-03W  [1N4148]
VD19  BAT62-03W  [1N4148]
VD20  (no value)  [1N4148]
VT1  (no value)  [SOT23_132]
X8  TX144  [CON: u.Fl]
X9  POWER 13.8  [CON: KNIFE_5MM]
X10  SMA  [CON: SMA]

### Ports
BWD_144 (out), FWD_144 (out), OD_144 (in), RF_IN_144 (out)

### Nets
+12V_144: C77.2 C79.2 R52.2 U10.3(Vdd) VT1.2(Исток) X9.1
GND: C64.2 C65.2 C66.2 C68.1 C69.1 C70.1 C72.1 C74.1 C75.1 C76.1 C77.1 C78.1 C79.1 C81.1 C82.1 C83.1 C84.1 C85.1 C86.2 C87.2 K2.1 L6.2 L7.2 L8.2 R46.1 R48.1 R50.1 R51.1 R54.1 R55.1 R56.2 U9.2(GND) VD20.1 X8.2(IN) X10.2(IN)
K_144: C74.2 C75.2 C87.1 DA1.3(Vin) K2.12 VD20.2 VT1.3(Сток)
BWD_144: R57.2 ; port BWD_144
FWD_144: R53.2 ; port FWD_144
OD_144: R52.1 VT1.1(Затвор(Gate)) ; port OD_144
RF_IN_144: K2.3 ; port RF_IN_144
NetC63_1: C63.1 U9.1(RF_IN)
NetC63_2: C63.2 R47.1 R48.2
NetC64_1: C64.1 C65.1 C66.1 C68.2 C69.2 DA1.2(Vout) DA1.4(Vout) FB4.1 L5.2 R49.2
NetC67_1: C67.1 L5.1 U9.3(RF_OUT)
NetC67_2: C67.2 C70.2 C71.1 L6.1
NetC71_2: C71.2 C72.2 C73.1 L7.1
NetC73_2: C73.2 C76.2 L8.1 U10.1(Pin)
NetC78_2: C78.2 R51.2 U10.2(Vgg)
NetC80_1: C80.1 C81.2 L9.1
NetC80_2: C80.2 U10.4(Pout)
NetC82_2: C82.2 L9.2 L10.1
NetC83_2: C83.2 L10.2 L11.1
NetC84_2: C84.2 L11.2 T5.1(IN)
NetC85_2: C85.2 R53.1 R54.2 VD18.2
NetC86_1: C86.1 R56.1 R57.1 VD19.2
NetDA1_1: DA1.1(GND) R49.1 R50.2
NetFB4_2: FB4.2 R51.3
NetK2_4: K2.4 X10.1(IN)
NetK2_5: K2.5 T5.5(OUT)
NetR46_2: R46.2 R47.2 X8.1(IN)
NetR55_2: R55.2 T5.3(R)
NetT5_2: T5.2(DFORW) VD18.1
NetT5_4: T5.4(DBACKW) VD19.1

### Notes on the sheet
- Перв. примен.
- Справ. №
- Подп. и дата
- Инв. № дубл.
- Взам. инв. №
- Инв. № подл.
- Изм.
- Лист
- № докум.
- Подп.
- Дата
- 2.106-A2
- Копировал
- Формат А2
- (in symbol 1-Connector) Конт.; Цепь
- (in symbol P-KANAL) D; S; G

### Library data of the parts
C63-C87 = Capacitor: Manufacturer: *; Model: *; HelpURL: *; ComponentKind: *; Value: *
DA1 = AMS117
FB4 = FB-1
L5-L8 = Inductor ring: Value: {Value}; Model: *; ComponentKind: *; Manufacturer: *; HelpURL: *
L9-L11 = TRANS-1
R46-R50 R52-R57 = Resistor: Manufacturer: *; Model: *; HelpURL: *; ComponentKind: *; Value: *
R51 = ADJ resistor: Manufacturer: *; Model: *; HelpURL: *; ComponentKind: *; Value: *
T5 = VHF_KSV1
VD18-VD20 = Diod: ComponentKind: *; Manufacturer: *; Model: *; HelpURL: *
VT1 = P-KANAL
X8 X10 = SMA: RF; Model: *; Manufacturer: *; HelpURL: *; ComponentKind: *
X9 = 1-Connector: Model: *; Manufacturer: *; HelpURL: *; ComponentKind: *

## Sheet WL_BPF.SchDoc
size 420 x 297 mm; SheetNumber: 8; SheetTotal: 9
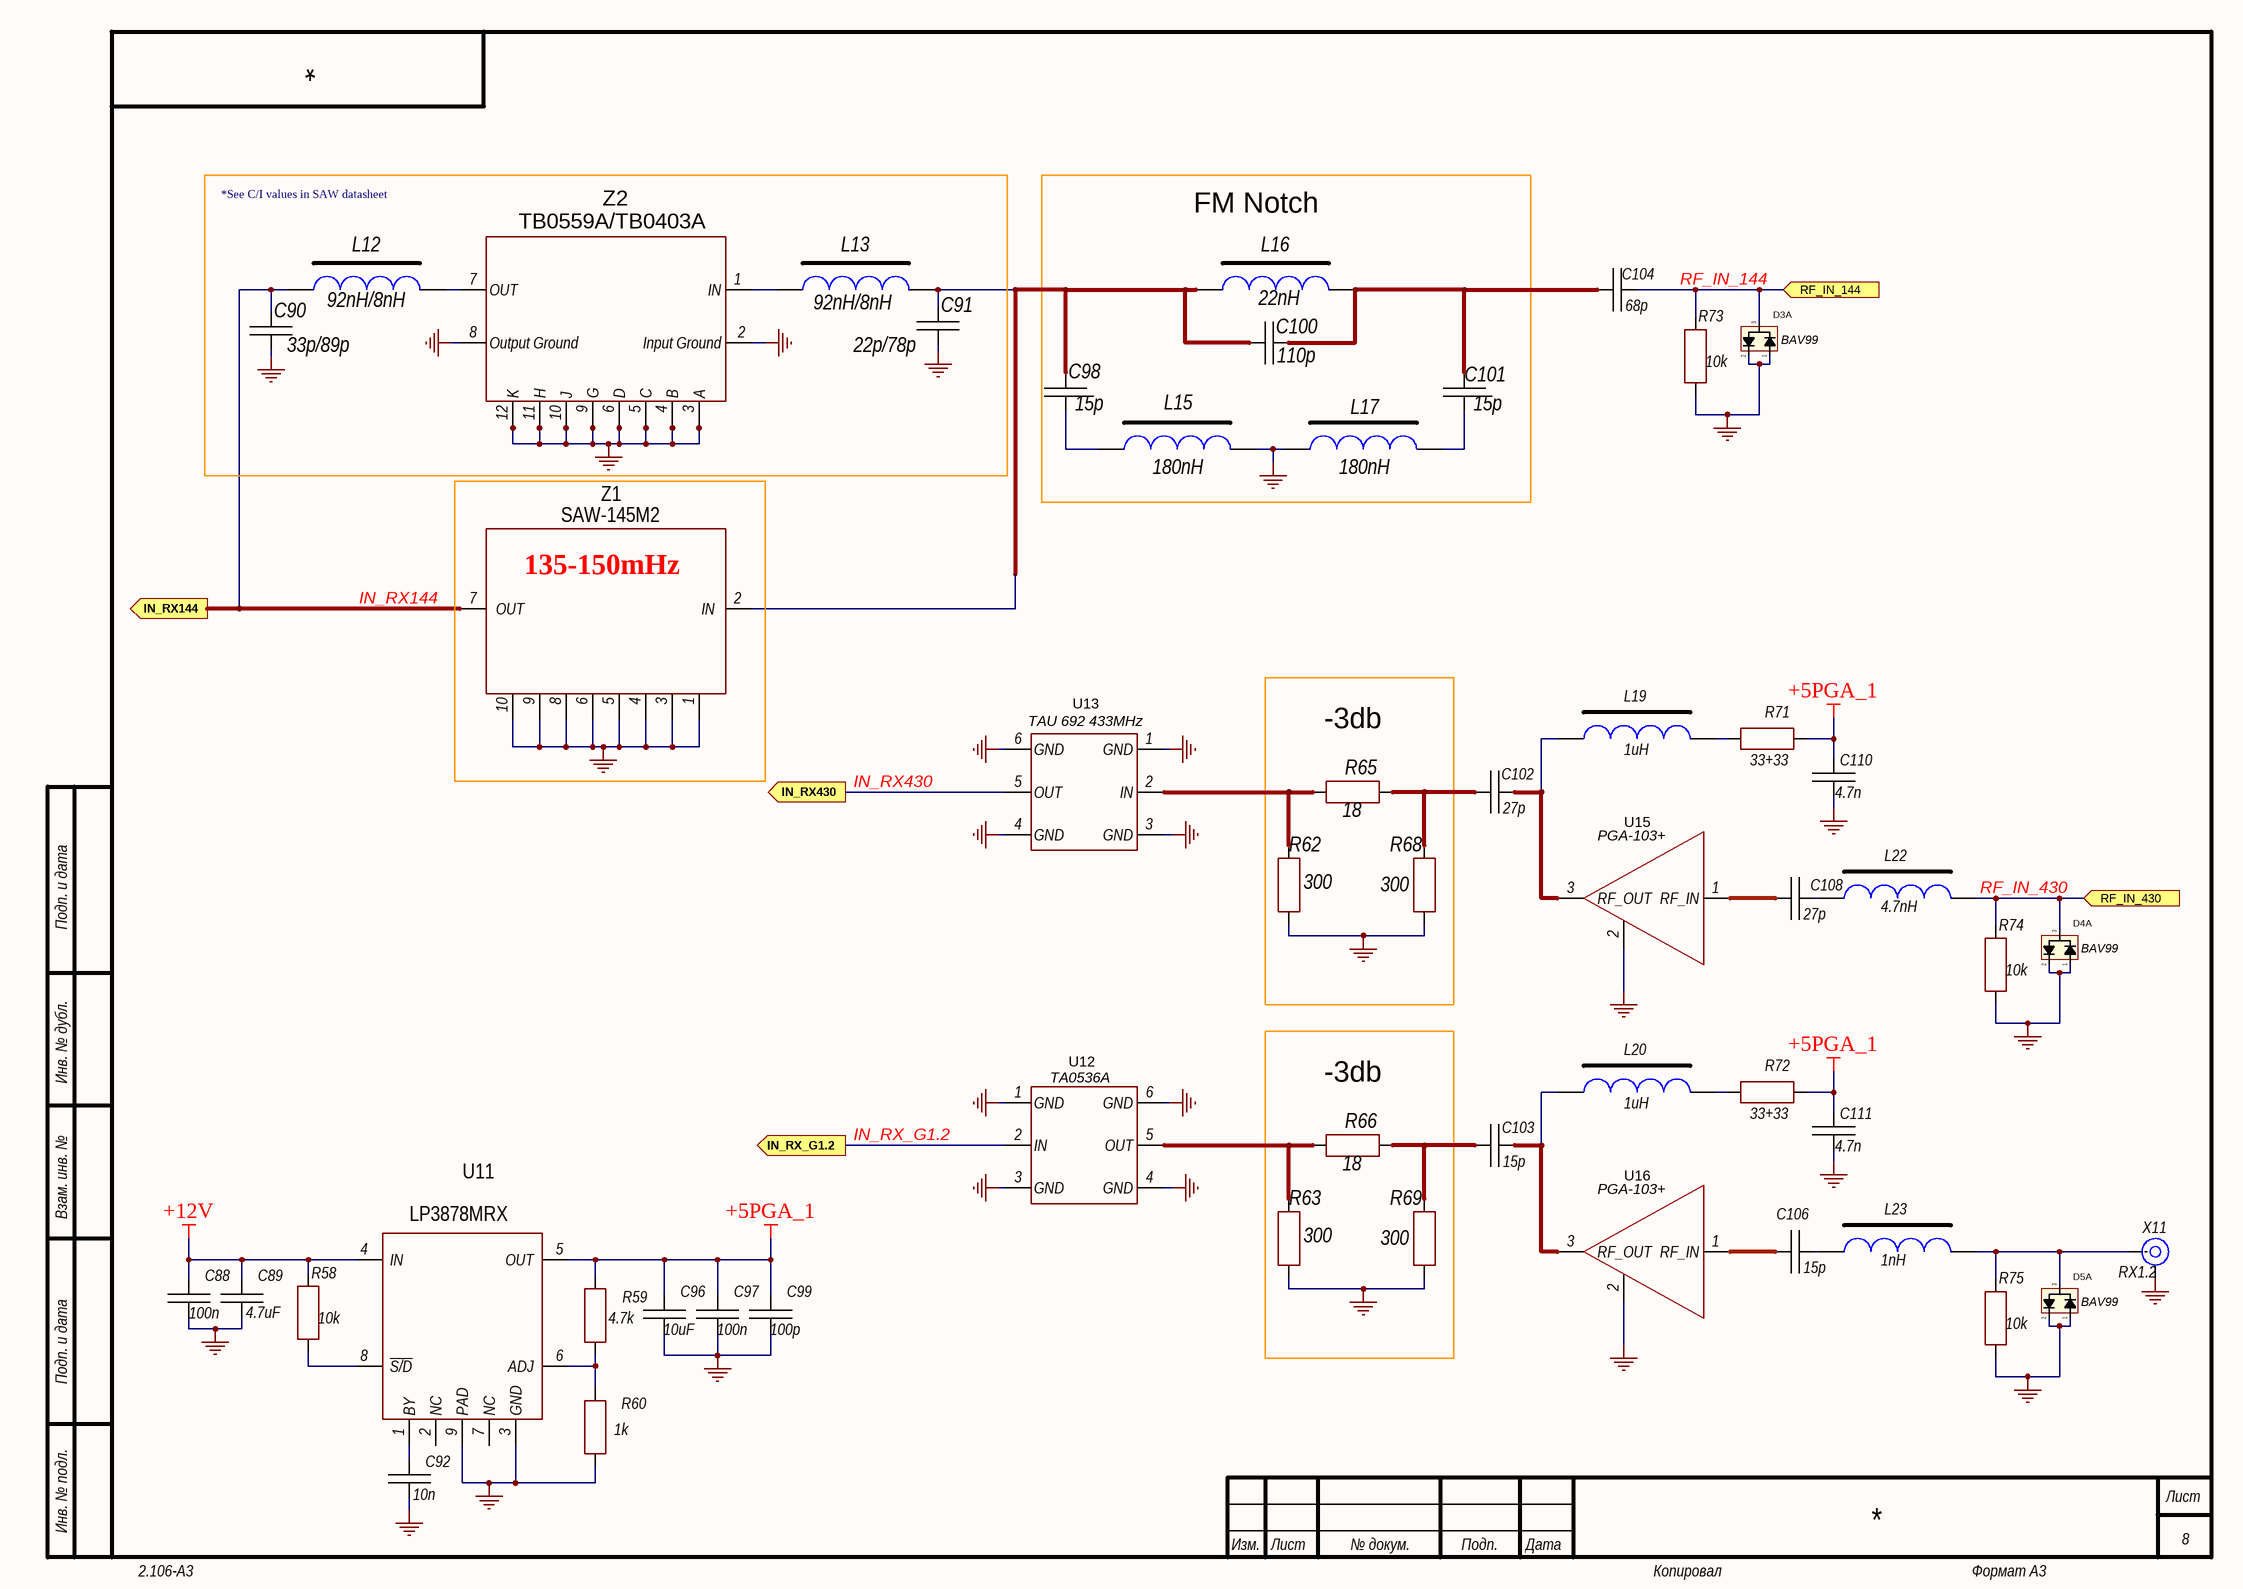
[diagram p6: WL_BPF.SchDoc]

### Parts
C88  100n  [CH0805C]
C89  4.7uF  [CH0805C]
C90  33p/89p  [CH0805C]
C91  22p/78p  [CH0805C]
C92  10n  [CH0805C]
C96  10uF  [CH0805C]
C97  100n  [CH0805C]
C98  15p  [CH0805C]
C99  100p  [CH0805C]
C100  110p  [CH0805C]
C101  15p  [CH0805C]
C102  27p  [CH0805C]
C103  15p  [CH0603C]
C104  68p  [CH0805C]
C106  15p  [CH0603C]
C108  27p  [CH0805C]
C110  4.7n  [CH0805C]
C111  4.7n  [CH0805C]
D3  BAV99  [SOT23_132]  (part A of 2)
D4  BAV99  [SOT23_132]  (part A of 2)
D5  BAV99  [SOT23_132]  (part A of 2)
L12  92nH/8nH  [L1210]
L13  92nH/8nH  [L1210]
L15  180nH  [L1210]
L16  22nH  [L1210]
L17  180nH  [L1210]
L19  1uH  [L1210]
L20  1uH  [L1210]
L22  4.7nH  [L1210]
L23  1nH  [L1210]
R58  10k  [CH0805R]
R59  4.7k  [CH0805R]
R60  1k  [CH0805R]
R62  300  [CH0805R]
R63  300  [CH0603R]
R65  18  [CH0805R]
R66  18  [CH0603R]
R68  300  [CH0805R]
R69  300  [CH0603R]
R71  33+33  [CH1206R]
R72  33+33  [CH1206R]
R73  10k  [CH0805R]
R74  10k  [CH0805R]
R75  10k  [CH0805R]
U11  LP3878MRX  [8-SOIC (PAD)]
U12  TA0536A  [MA08803]
U13  TAU 692 433MHz  [TAU692]
U15  PGA-103+  [SOT89_123]
U16  PGA-103+  [SOT89_123]
X11  RX1.2  [CON: u.Fl]
Z1  SAW-145M2  [PAV]
Z2  TB0559A/TB0403A  [TB0559A/TB0403A]

### Blocks framed on the sheet
*See C/I values in SAW datasheet: C90 C91 L12 L13 Z2
FM Notch: C98 C100 C101 L15-L17
135-150mHz: Z1
-3db: R62 R65 R68
-3db: R63 R66 R69

### Ports
IN_RX144 (out), IN_RX430 (out), IN_RX_G1.2 (out), RF_IN_144 (in), RF_IN_430 (in)

### Nets
+5PGA_1: C96.2 C97.2 C99.2 C110.2 C111.2 R59.2 R71.2 R72.2 U11.5(OUT)
+12V: C88.2 C89.2 R58.2 U11.4(IN)
GND: C88.1 C89.1 C90.1 C91.1 C92.1 C96.1 C97.1 C99.1 C110.1 C111.1 D3.1 D3.2 D4.1 D4.2 D5.1 D5.2 L15.2 L17.1 R60.1 R62.2 R63.2 R68.2 R69.2 R73.1 R74.1 R75.1 U11.3(GND) U11.9(PAD) U12.1(GND) U12.3(GND) U12.4(GND) U12.6(GND) U13.1(GND) U13.3(GND) U13.4(GND) U13.6(GND) U15.2(GND) U16.2(GND) X11.2(IN) Z1.1(RESET) Z1.3(CH_PD) Z1.4(GPIO16) Z1.5(GPIO14) Z1.6(GPIO0) Z1.8(GPIO5) Z1.9(RXD) Z1.10(TXD) Z2.2(Input_Ground) Z2.3(A) Z2.4(B) Z2.5(C) Z2.6(D) Z2.8(Output_Ground) Z2.9(G) Z2.10(J) Z2.11(H) Z2.12(K)
IN_RX144: C90.2 L12.1 Z1.7(OUT) ; port IN_RX144
IN_RX430: U13.5(OUT) ; port IN_RX430
IN_RX_G1.2: U12.2(IN) ; port IN_RX_G1.2
RF_IN_144: C104.2 D3.3 R73.2 ; port RF_IN_144
RF_IN_430: D4.3 L22.1 R74.2 ; port RF_IN_430
NetC91_2: C91.2 C98.2 C100.1 L13.2 L16.1 Z1.2(IN)
NetC92_2: C92.2 U11.1(BY)
NetC98_1: C98.1 L15.1
NetC100_2: C100.2 C101.2 C104.1 L16.2
NetC101_1: C101.1 L17.2
NetC102_1: C102.1 R65.1 R68.1
NetC102_2: C102.2 L19.2 U15.3(RF_OUT)
NetC103_1: C103.1 R66.1 R69.1
NetC103_2: C103.2 L20.2 U16.3(RF_OUT)
NetC106_1: C106.1 U16.1(RF_IN)
NetC106_2: C106.2 L23.2
NetC108_1: C108.1 U15.1(RF_IN)
NetC108_2: C108.2 L22.2
NetD5_3: D5.3 L23.1 R75.2 X11.1(IN)
NetL12_2: L12.2 Z2.7(OUT)
NetL13_1: L13.1 Z2.1(IN)
NetL19_1: L19.1 R71.1
NetL20_1: L20.1 R72.1
NetR58_1: R58.1 U11.8(~{S/D})
NetR59_1: R59.1 R60.2 U11.6(ADJ)
NetR62_1: R62.1 R65.2 U13.2(IN)
NetR63_1: R63.1 R66.2 U12.5(OUT)

Not connected (* = marked no-connect by the designer): U11 2(NC) 7(NC)

### Notes on the sheet
- Подп. и дата
- Инв. № дубл.
- Взам. инв. №
- Инв. № подл.
- Изм.
- Лист
- № докум.
- Подп.
- Дата
- 2.106-A3
- Копировал
- Формат А3

### Library data of the parts
C88-C92 C96-C104 C106 C108 C110 C111 = Capacitor: Manufacturer: *; Model: *; HelpURL: *; ComponentKind: *; Value: *
L12 L13 L15-L17 L19 L20 L22 L23 = TRANS
R58-R60 R62 R63 R65 R66 R68 R69 R71-R75 = Resistor: Manufacturer: *; Model: *; HelpURL: *; ComponentKind: *; Value: *
U11 = LP3878
U12 U13 = TAU692
X11 = SMA: RF; Model: *; Manufacturer: *; HelpURL: *; ComponentKind: *
Z1 = SXBP_PAW

## Sheet WL_430.SchDoc
size A3; SheetNumber: 9; SheetTotal: 9
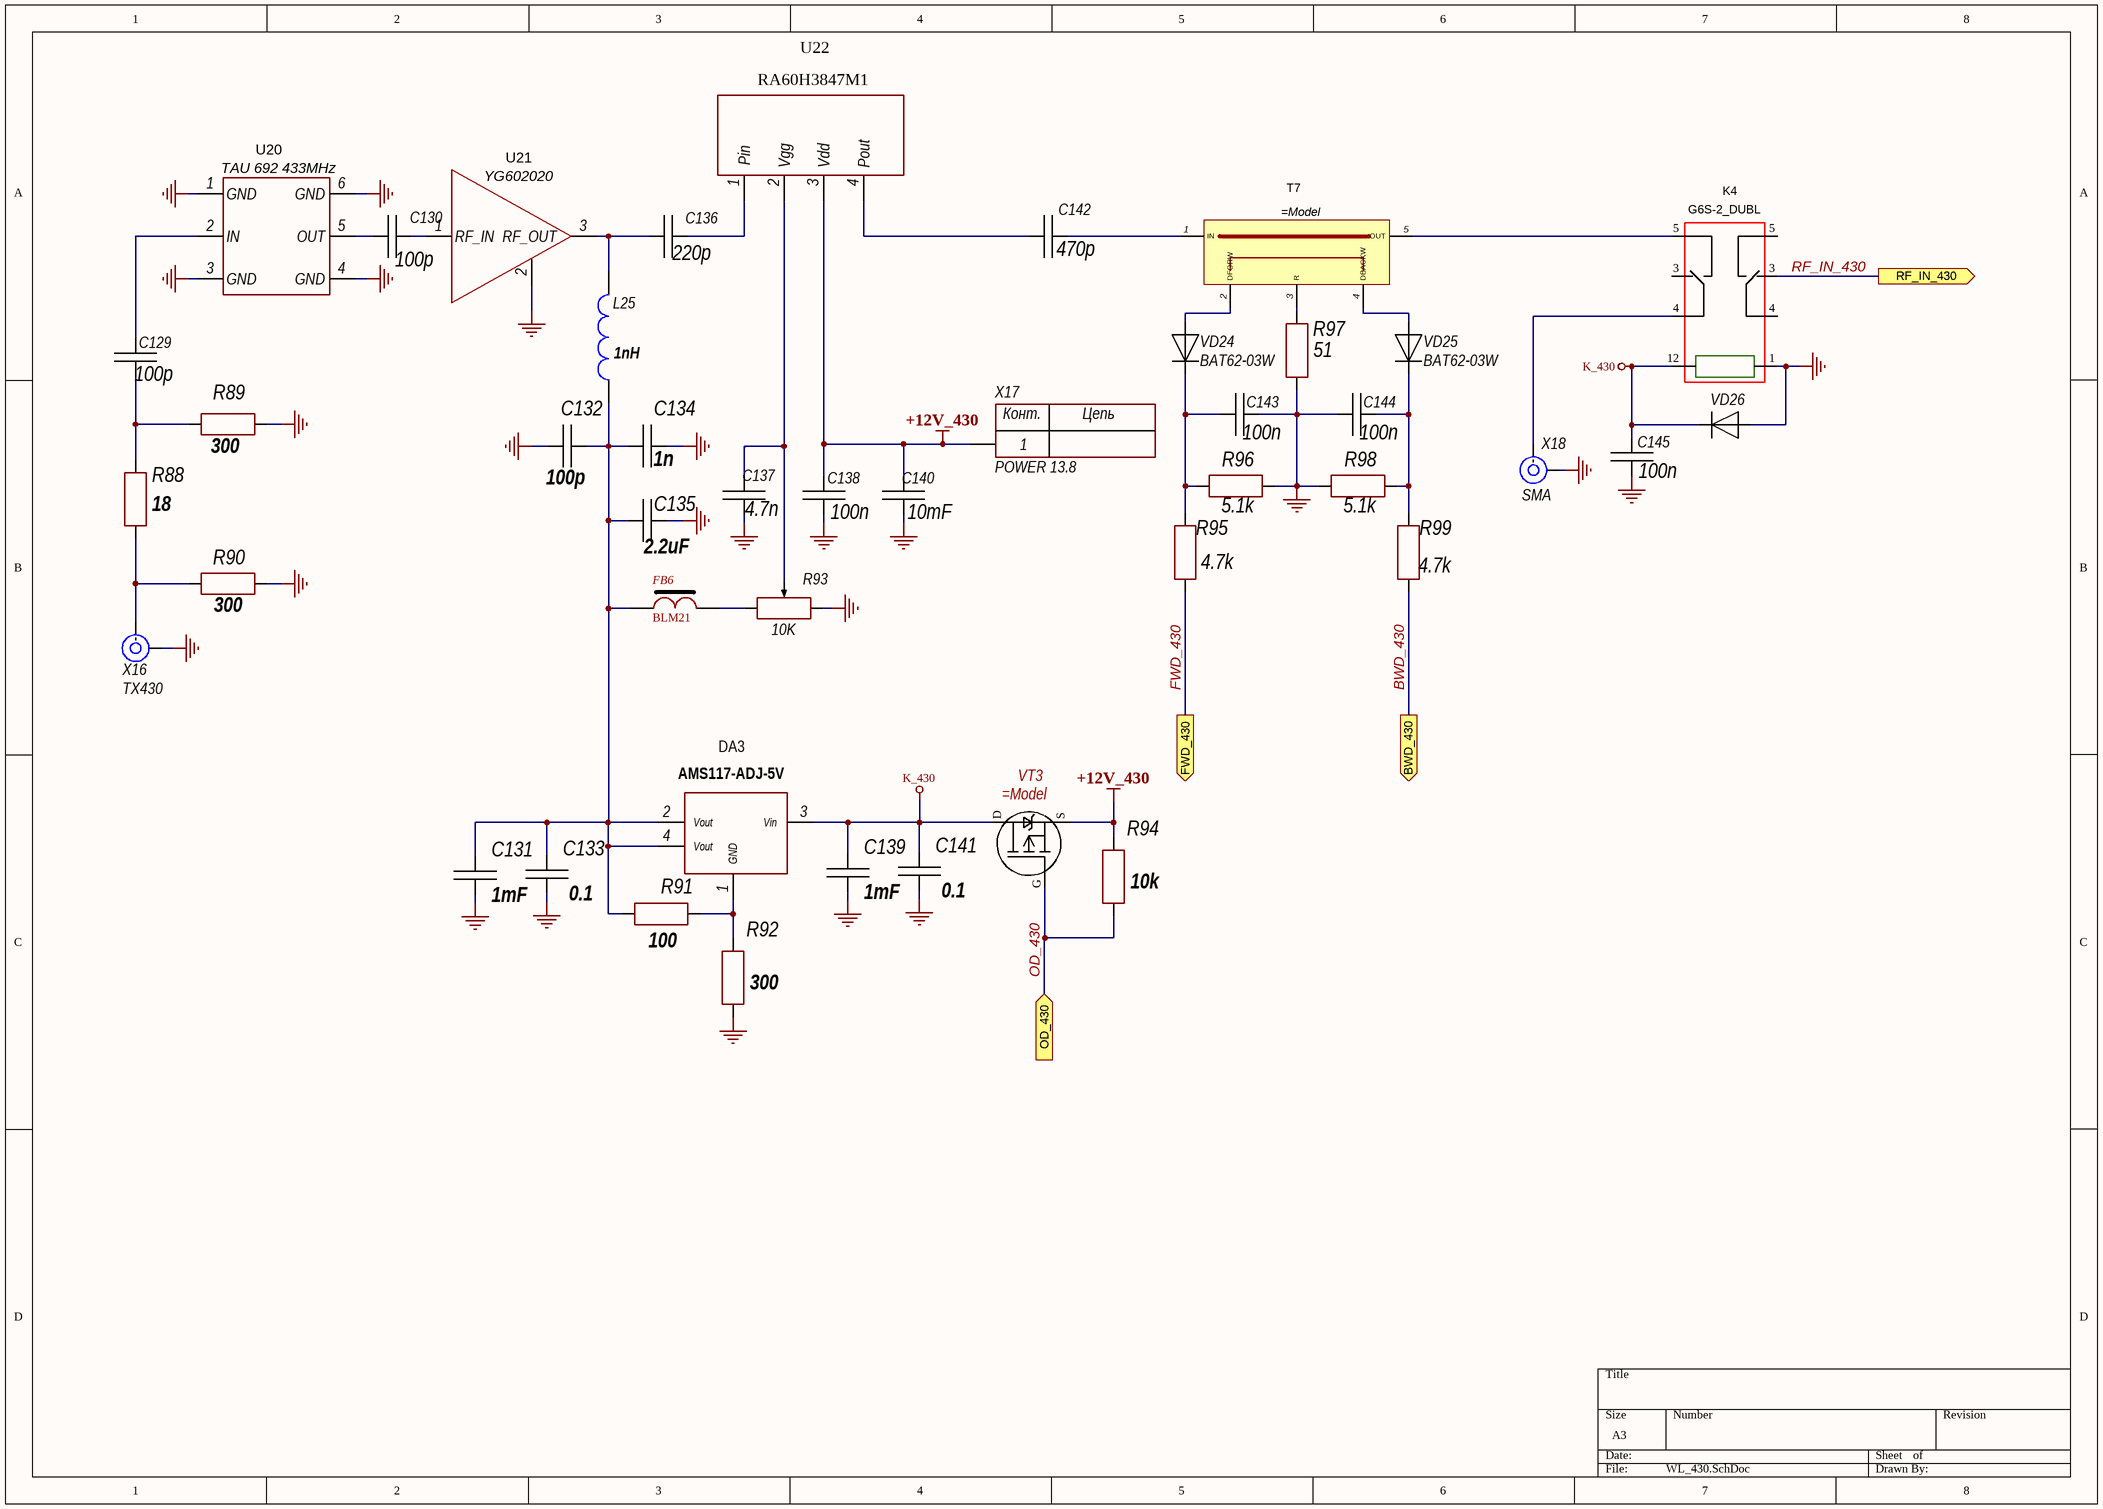
[diagram p7: WL_430.SchDoc]

### Parts
C129  100p  [CH0805C]
C130  100p  [CH0805C]
C131  1mF  [CH0805C]
C132  100p  [CH0805C]
C133  0.1  [CH0805C]
C134  1n  [CH0805C]
C135  2.2uF  [CH0805C]
C136  220p  [CH0805C]
C137  4.7n  [CH0805C]
C138  100n  [CH1206C]
C139  1mF  [CH0805C]
C140  10mF  [CH1206C]
C141  0.1  [CH0805C]
C142  470p  [CH1210C]
C143  100n  [CH0805C]
C144  100n  [CH0805C]
C145  100n  [CH0805C]
DA3  AMS117-ADJ-5V  [SOT223]
FB6  BLM21  [CH0805L]
K4  G6S-2_DUBL  [G6S-2_DUBL]
L25  1nH  [katuhka]
R88  18  [CH0805R]
R89  300  [CH0805R]
R90  300  [CH0805R]
R91  100  [CH0805R]
R92  300  [CH0805R]
R93  10K  [RES: 3296W]
R94  10k  [CH0805R]
R95  4.7k  [CH0805R]
R96  5.1k  [CH0805R]
R97  51  [CH1206R]
R98  5.1k  [CH0805R]
R99  4.7k  [CH0805R]
T7  (no value)  [SWR_D]
U20  TAU 692 433MHz  [TAU692]
U21  YG602020  [SOT89_123]
U22  RA60H3847M1  [RA80H1415M1 - duplicate]
VD24  BAT62-03W  [1N4148]
VD25  BAT62-03W  [1N4148]
VD26  (no value)  [1N4148]
VT3  (no value)  [SOT23_132]
X16  TX430  [CON: u.Fl]
X17  POWER 13.8  [CON: KNIFE_5MM]
X18  SMA  [CON: SMA]

### Ports
BWD_430 (out), FWD_430 (out), OD_430 (in), RF_IN_430 (out)

### Nets
+12V_430: C138.2 C140.2 R94.2 U22.3(Vdd) VT3.2(Исток) X17.1
GND: C131.1 C132.2 C133.1 C134.2 C135.2 C137.1 C138.1 C139.1 C140.1 C141.1 C143.1 C144.2 C145.2 K4.1 R89.1 R90.1 R92.1 R93.1 R96.1 R97.1 R98.2 U20.1(GND) U20.3(GND) U20.4(GND) U20.6(GND) U21.2(GND) VD26.1 X16.2(IN) X18.2(IN)
K_430: C139.2 C141.2 C145.1 DA3.3(Vin) K4.12 VD26.2 VT3.3(Сток)
BWD_430: R99.2 ; port BWD_430
FWD_430: R95.2 ; port FWD_430
OD_430: R94.1 VT3.1(Затвор(Gate)) ; port OD_430
RF_IN_430: K4.3 ; port RF_IN_430
NetC129_1: C129.1 U20.2(IN)
NetC129_2: C129.2 R88.1 R89.2
NetC130_1: C130.1 U21.1(RF_IN)
NetC130_2: C130.2 U20.5(OUT)
NetC131_2: C131.2 C132.1 C133.2 C134.1 C135.1 DA3.2(Vout) DA3.4(Vout) FB6.1 L25.2 R91.2
NetC136_1: C136.1 U22.1(Pin)
NetC136_2: C136.2 L25.1 U21.3(RF_OUT)
NetC137_2: C137.2 R93.2 U22.2(Vgg)
NetC142_1: C142.1 T7.1(IN)
NetC142_2: C142.2 U22.4(Pout)
NetC143_2: C143.2 R95.1 R96.2 VD24.2
NetC144_1: C144.1 R98.1 R99.1 VD25.2
NetDA3_1: DA3.1(GND) R91.1 R92.2
NetFB6_2: FB6.2 R93.3
NetK4_4: K4.4 X18.1(IN)
NetK4_5: K4.5 T7.5(OUT)
NetR88_2: R88.2 R90.2 X16.1(IN)
NetR97_2: R97.2 T7.3(R)
NetT7_2: T7.2(DFORW) VD24.1
NetT7_4: T7.4(DBACKW) VD25.1

### Notes on the sheet
- (in symbol 1-Connector) Конт.; Цепь
- (in symbol P-KANAL) D; S; G

### Library data of the parts
C129-C145 = Capacitor: Manufacturer: *; Model: *; HelpURL: *; ComponentKind: *; Value: *
DA3 = AMS117
FB6 = FB-1
L25 = Inductor ring: Value: {Value}; Model: *; ComponentKind: *; Manufacturer: *; HelpURL: *
R88-R92 R94-R99 = Resistor: Manufacturer: *; Model: *; HelpURL: *; ComponentKind: *; Value: *
R93 = ADJ resistor: Manufacturer: *; Model: *; HelpURL: *; ComponentKind: *; Value: *
T7 = VHF_KSV1
U20 = TAU692
U22 = RA80H1415M1
VD24-VD26 = Diod: ComponentKind: *; Manufacturer: *; Model: *; HelpURL: *
VT3 = P-KANAL
X16 X18 = SMA: RF; Model: *; Manufacturer: *; HelpURL: *; ComponentKind: *
X17 = 1-Connector: Model: *; Manufacturer: *; HelpURL: *; ComponentKind: *

## Nets that join several sheets
+3.3V: WL_RFFC (24 pins), WL_PGA_ATT (5 pins), WL_CON (11 pins), WL_RF_SWITCH (C61.1 C62.1 D1.2 D2.2)
+5IN: WL_RFFC (C1.2 U1.13 U1.15 U1.16), WL_CON (X4.1)
+12V: WL_PGA_ATT (5 pins), WL_CON (C146.2 U8.9 X21.1), WL_BPF (C88.2 C89.2 R58.2 U11.4)
GND: WL_1.2G (30 pins), WL_RFFC (56 pins), WL_PGA_ATT (31 pins), WL_CON (15 pins), WL_RF_SWITCH (28 pins), WL_144 (35 pins), WL_BPF (57 pins), WL_430 (29 pins)
ATT_1: WL_PGA_ATT (C54.2 U5.19), WL_CON (U6.16)
ATT_2: WL_PGA_ATT (C55.2 U5.17), WL_CON (U6.17)
ATT_4: WL_PGA_ATT (C50.2 U5.16), WL_CON (U6.18)
ATT_8: WL_PGA_ATT (C51.2 U5.15), WL_CON (U6.19)
ATT_16: WL_PGA_ATT (C52.2 U5.1), WL_CON (U6.14)
BWD_1.2: WL_1.2G (R87.2), WL_CON (U7.6)
BWD_144: WL_CON (U7.2), WL_144 (R57.2)
BWD_430: WL_CON (U7.3), WL_430 (R99.2)
D1_V1: WL_CON (U6.9), WL_RF_SWITCH (D1.4)
D1_V2: WL_CON (U6.10), WL_RF_SWITCH (D1.3)
D2_V1: WL_CON (U6.13), WL_RF_SWITCH (D2.4)
D2_V2: WL_CON (U6.11), WL_RF_SWITCH (D2.3)
ENX: WL_RFFC (C17.2 U2.30), WL_CON (X3.1)
FWD_1.2: WL_1.2G (R83.2), WL_CON (U7.5)
FWD_144: WL_CON (U7.1), WL_144 (R53.2)
FWD_430: WL_CON (U7.4), WL_430 (R95.2)
IN_PGA: WL_PGA_ATT (U5.2), WL_RF_SWITCH (D1.11)
IN_RX144: WL_RF_SWITCH (D1.6), WL_BPF (C90.2 L12.1 Z1.7)
IN_RX430: WL_RF_SWITCH (D1.8), WL_BPF (U13.5)
IN_RX_G1.2: WL_RF_SWITCH (D1.13), WL_BPF (U12.2)
OD_1.2G: WL_1.2G (R82.1 VT2.1), WL_CON (U8.12)
OD_144: WL_CON (U8.13), WL_144 (R52.1 VT1.1)
OD_430: WL_CON (U8.14), WL_430 (R94.1 VT3.1)
OD_PGA: WL_PGA_ATT (K1.8), WL_CON (U8.10)
PGA_ON: WL_PGA_ATT (U3.8), WL_CON (R45.1 U6.20 U8.7)
RF_IN_144: WL_144 (K2.3), WL_BPF (C104.2 D3.3 R73.2)
RF_IN_430: WL_BPF (D4.3 L22.1 R74.2), WL_430 (K4.3)
RX_IN_ PGA: WL_RFFC (C34.1), WL_PGA_ATT (K1.3)
SCL: WL_RFFC (C15.2 U2.31), WL_CON (R24.2 U6.22 U7.14 X3.3)
SDA: WL_RFFC (C11.2 U2.32), WL_CON (R23.2 U6.23 U7.15 X3.2)
TX_SW_OUT: WL_RFFC (C12.1), WL_RF_SWITCH (D2.11)